# EAGLE design LunettaAV_WIP (EAGLE 9.6.2)
CNAME: Sourya Sen; CREVISION: 0.0.2

## Sheet 1 of 2
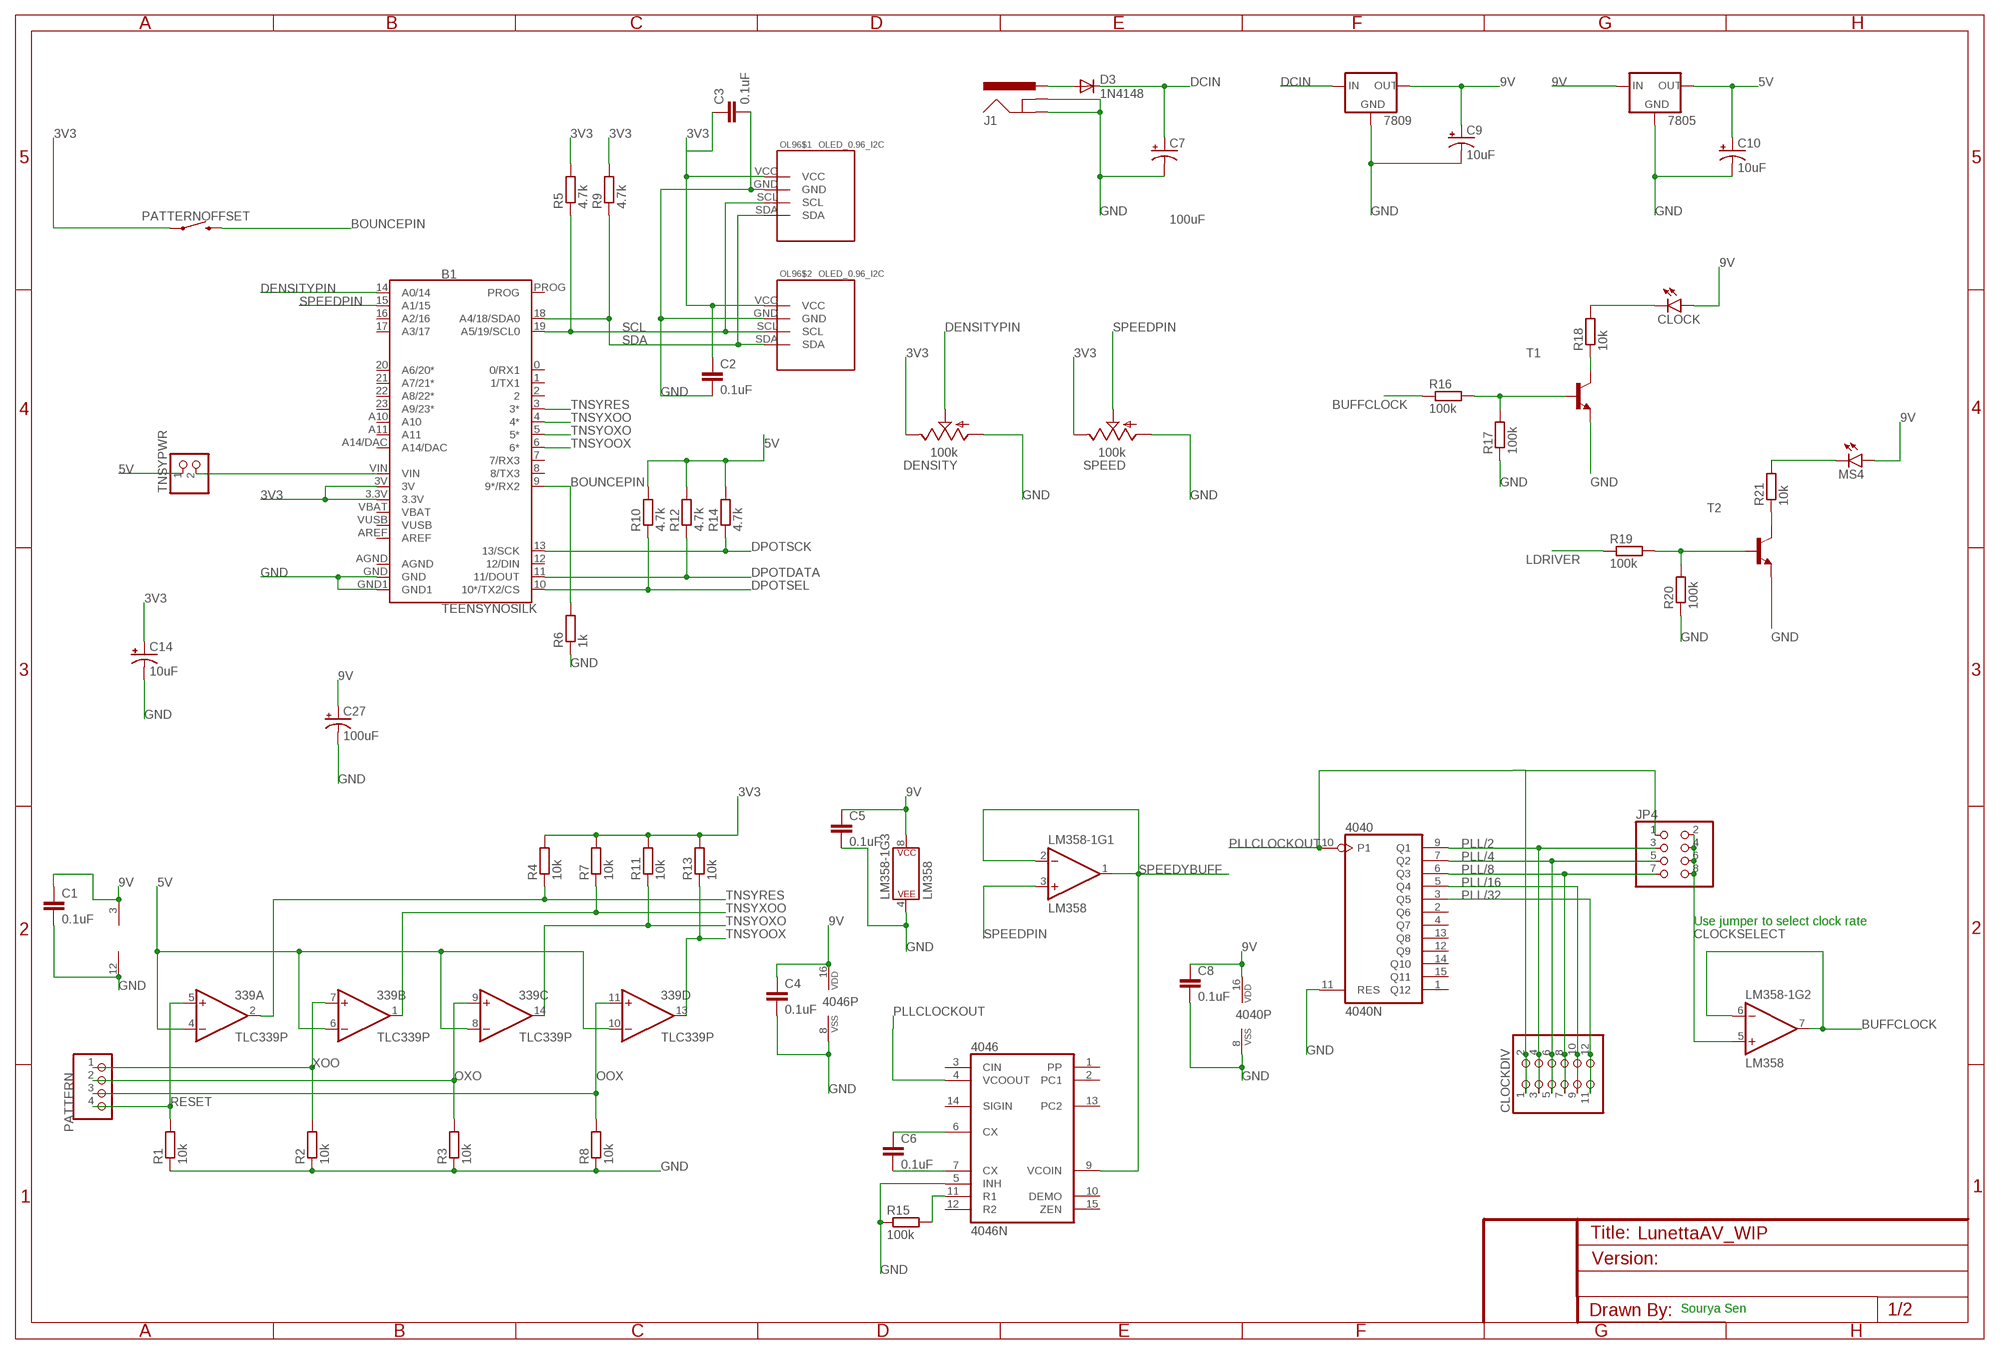
[diagram p0: schematic, sheet 1]

### Parts
339  TLC339P  [DIL14]
4040  4040N  [DIL16]
4046  4046N  [DIL16]
7805  7805  78XXS  [78XXS]
7809  7809  78XXS  [78XXS]
B1  TEENSYNOSILK  [TEENSY_NOSILK]
C1  0.1uF  0.1UF-KIT-EZ-50V-20%  [CAP-PTH-SMALL-KIT]
C2  0.1uF  0.1UF-KIT-EZ-50V-20%  [CAP-PTH-SMALL-KIT]
C3  0.1uF  0.1UF-KIT-EZ-50V-20%  [CAP-PTH-SMALL-KIT]
C4  0.1uF  0.1UF-KIT-EZ-50V-20%  [CAP-PTH-SMALL-KIT]
C5  0.1uF  0.1UF-KIT-EZ-50V-20%  [CAP-PTH-SMALL-KIT]
C6  0.1uF  0.1UF-KIT-EZ-50V-20%  [CAP-PTH-SMALL-KIT]
C7  100uF  100UF-POLAR-RADIAL-2.5MM-25V-20%  [CPOL-RADIAL-2.5MM-6.5MM]
C8  0.1uF  0.1UF-KIT-EZ-50V-20%  [CAP-PTH-SMALL-KIT]
C9  10uF  10UF-POLAR-RADIAL-2.5MM-25V-20%  [CPOL-RADIAL-2.5MM-5MM]
C10  10uF  10UF-POLAR-RADIAL-2.5MM-25V-20%  [CPOL-RADIAL-2.5MM-5MM]
C14  10uF  10UF-POLAR-RADIAL-2.5MM-25V-20%  [CPOL-RADIAL-2.5MM-5MM]
C27  100uF  100UF-POLAR-RADIAL-2.5MM-25V-20%  [CPOL-RADIAL-2.5MM-6.5MM]
CLOCK  LED3MM  [LED_3MM]
CLOCKDIV  PINHD-2X6  [2X06]
D3  1N4148  SMALL_DIODEDO35-7  [DO35-7]
DENSITY  100k  9MM_SNAP-IN_POT_  [9MM_SNAP-IN_POT]
J1  POWER_JACKPOWER_JACK_SLOT  [POWER_JACK_PTH_SLOT]
JP4  PINHD-2X4  [2X04]
LM358-1  LM358  [DIP08]
MS4  LED3MM  [LED_3MM]
OL96$1  OLED_0.96_I2C  [OLED_0.96_I2C]
OL96$2  OLED_0.96_I2C  [OLED_0.96_I2C]
PATTERN  PINHD-1X4  [1X04]
PATTERNOFFSET  MOMENTARY-SWITCH-SPST-PTH-12MM  [TACTILE_SWITCH_PTH_12MM]
R1  10k  RESISTOR7MM  [7MM_RESISTOR]
R2  10k  RESISTOR7MM  [7MM_RESISTOR]
R3  10k  RESISTOR7MM  [7MM_RESISTOR]
R4  10k  RESISTOR7MM  [7MM_RESISTOR]
R5  4.7k  RESISTOR7MM  [7MM_RESISTOR]
R6  1k  RESISTOR7MM  [7MM_RESISTOR]
R7  10k  RESISTOR7MM  [7MM_RESISTOR]
R8  10k  RESISTOR7MM  [7MM_RESISTOR]
R9  4.7k  RESISTOR7MM  [7MM_RESISTOR]
R10  4.7k  RESISTOR7MM  [7MM_RESISTOR]
R11  10k  RESISTOR7MM  [7MM_RESISTOR]
R12  4.7k  RESISTOR7MM  [7MM_RESISTOR]
R13  10k  RESISTOR7MM  [7MM_RESISTOR]
R14  4.7k  RESISTOR7MM  [7MM_RESISTOR]
R15  100k  RESISTOR7MM  [7MM_RESISTOR]
R16  100k  RESISTOR7MM  [7MM_RESISTOR]
R17  100k  RESISTOR7MM  [7MM_RESISTOR]
R18  10k  RESISTOR7MM  [7MM_RESISTOR]
R19  100k  RESISTOR7MM  [7MM_RESISTOR]
R20  100k  RESISTOR7MM  [7MM_RESISTOR]
R21  10k  RESISTOR7MM  [7MM_RESISTOR]
SPEED  100k  9MM_SNAP-IN_POT_  [9MM_SNAP-IN_POT]
T1  2N4401-NPN-TO92-EBC  [TO92-EBC]
T2  2N4401-NPN-TO92-EBC  [TO92-EBC]
TNSYPWR  PINHD-1X2  [1X02]

### Nets
3V3 [POWER]: B1.3.3V B1.3V C2.1 C3.1 C14.1(+) DENSITY.3(E) OL96$1.VCC OL96$2.VCC PATTERNOFFSET.1 R4.2 R5.2 R7.2 R9.2 R11.2 R13.2 SPEED.3(E)
5V [POWER]: 339.4(A:-IN) 339.6(B:-IN) 339.8(C:-IN) 339.10(D:-IN) 7805.OUT C10.1(+) R10.2 R12.2 R14.2 TNSYPWR.1 ; also sheet 2
9V [POWER]: 339.3(P:V+) 4040.16(VDD) 4046.16(VDD) 7805.IN 7809.OUT C1.1 C4.1 C5.1 C8.1 C9.1(+) C27.1(+) CLOCK.A LM358-1.8(P$V+) MS4.A ; also sheet 2
BOUNCEPIN: B1.9(9*/RX2) PATTERNOFFSET.3 R6.2
BUFFCLOCK: LM358-1.6(-IN) LM358-1.7(OUT) R16.1 ; also sheet 2
CLOCKSELECT: JP4.2 JP4.4 JP4.6 JP4.8 LM358-1.5(+IN)
DCIN: 7809.IN C7.1(+) D3.C
DENSITYPIN: B1.14(A0/14) DENSITY.2(S)
DPOTDATA [COMMS]: B1.11(11/DOUT) R12.1 ; also sheet 2
DPOTSCK [COMMS]: B1.13(13/SCK) R14.1 ; also sheet 2
DPOTSEL [COMMS]: B1.10(10*/TX2/CS) R10.1 ; also sheet 2
GND [POWER]: 339.12(P:V-) 4040.8(VSS) 4040.11(RES) 4046.5(INH) 4046.8(VSS) 7805.GND 7809.GND B1.GND B1.GND1 C1.2 C2.2 C3.2 C4.2 C5.2 C7.2(-) C8.2 C9.2(-) C10.2(-) C14.2(-) C27.2(-) DENSITY.1(A) J1.GND J1.GNDBREAK LM358-1.4(P$V-) OL96$1.GND OL96$2.GND R1.1 R2.1 R3.1 R6.1 R8.1 R15.1 R17.1 R20.1 SPEED.1(A) T1.E T2.E ; also sheet 2
LDRIVER: R19.1 ; also sheet 2
N$1: B1.VIN TNSYPWR.2
N$2: 4046.7(CX) C6.2
N$5: 4046.6(CX) C6.1
N$6: 4046.11(R1) R15.2
N$34: R16.2 R17.2 T1.B
N$35: R18.1 T1.C
N$36: CLOCK.K(C) R18.2
N$37: R19.2 R20.2 T2.B
N$38: R21.1 T2.C
N$39: MS4.K(C) R21.2
N$42: D3.A J1.PWR
OOX: 339.11(D:+IN) PATTERN.3 R8.2
OXO: 339.9(C:+IN) PATTERN.2 R3.2
PLL/2: 4040.9(Q1) CLOCKDIV.3 CLOCKDIV.4 JP4.3
PLL/4: 4040.7(Q2) CLOCKDIV.5 CLOCKDIV.6 JP4.5
PLL/8: 4040.6(Q3) CLOCKDIV.7 CLOCKDIV.8 JP4.7
PLL/16: 4040.5(Q4) CLOCKDIV.9 CLOCKDIV.10
PLL/32: 4040.3(Q5) CLOCKDIV.11 CLOCKDIV.12
PLLCLOCKOUT: 4040.10(P1) 4046.4(VCOOUT) CLOCKDIV.1 CLOCKDIV.2 JP4.1
RESET: 339.5(A:+IN) PATTERN.4 R1.2
SCL [COMMS]: B1.19(A5/19/SCL0) OL96$1.SCL OL96$2.SCL R5.1
SDA [COMMS]: B1.18(A4/18/SDA0) OL96$1.SDA OL96$2.SDA R9.1
SPEEDPIN: B1.15(A1/15) LM358-1.3(+IN) SPEED.2(S)
SPEEDYBUFF: 4046.9(VCOIN) LM358-1.1(OUT) LM358-1.2(-IN)
TNSYOOX: 339.13(D:OUT) B1.6(6*) R13.1
TNSYOXO: 339.14(C:OUT) B1.5(5*) R11.1
TNSYRES: 339.2(A:OUT) B1.3(3*) R4.1
TNSYXOO: 339.1(B:OUT) B1.4(4*) R7.1
XOO: 339.7(B:+IN) PATTERN.1 R2.2
Unconnected: 4040.1(Q12) 4040.2(Q6) 4040.4(Q7) 4040.12(Q9) 4040.13(Q8) 4040.14(Q10) 4040.15(Q11) 4046.1(PP) 4046.2(PC1) 4046.3(CIN) 4046.10(DEMO) 4046.12(R2) 4046.13(PC2) 4046.14(SIGIN) 4046.15(ZEN) B1.0(0/RX1) B1.1(1/TX1) B1.2 B1.7(7/RX3) B1.8(8/TX3) B1.12(12/DIN) B1.16(A2/16) B1.17(A3/17) B1.20(A6/20*) B1.21(A7/21*) B1.22(A8/22*) B1.23(A9/23*) B1.A10 B1.A11 B1.A14/DAC B1.AREF B1.PROG

### Notes on the sheet
- Use jumper to select clock rate
- Sourya Sen

## Sheet 2 of 2
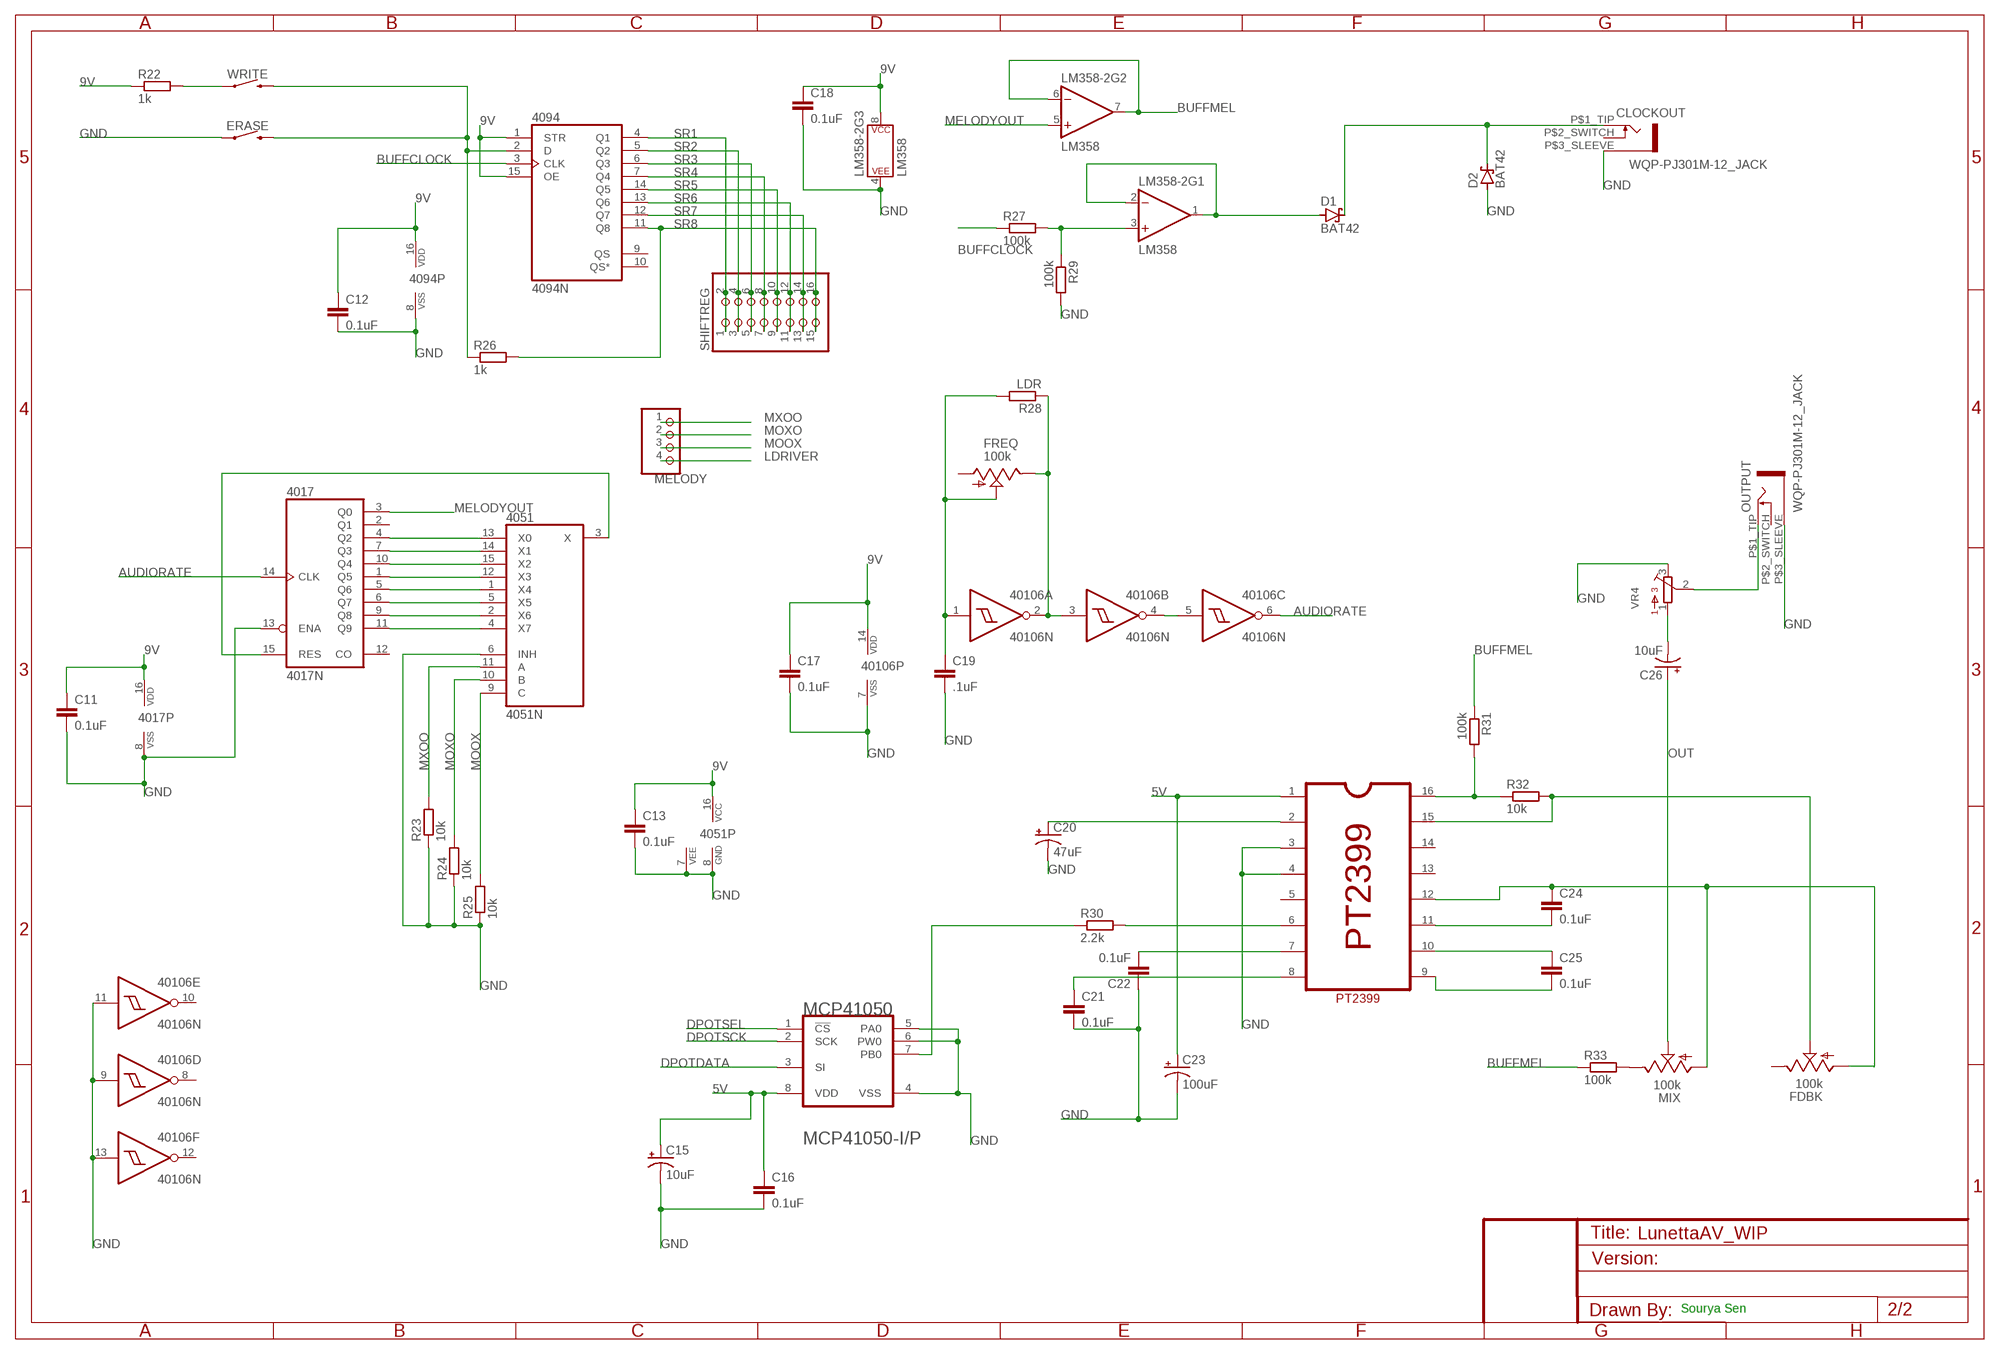
[diagram p1: schematic, sheet 2]

### Parts
4017  4017N  [DIL16]
4051  4051N  [DIL16]
4094  4094N  [DIL16]
40106  40106N  [DIL14]
C11  0.1uF  0.1UF-KIT-EZ-50V-20%  [CAP-PTH-SMALL-KIT]
C12  0.1uF  0.1UF-KIT-EZ-50V-20%  [CAP-PTH-SMALL-KIT]
C13  0.1uF  0.1UF-KIT-EZ-50V-20%  [CAP-PTH-SMALL-KIT]
C15  10uF  10UF-POLAR-RADIAL-2.5MM-25V-20%  [CPOL-RADIAL-2.5MM-5MM]
C16  0.1uF  0.1UF-KIT-EZ-50V-20%  [CAP-PTH-SMALL-KIT]
C17  0.1uF  0.1UF-KIT-EZ-50V-20%  [CAP-PTH-SMALL-KIT]
C18  0.1uF  0.1UF-KIT-EZ-50V-20%  [CAP-PTH-SMALL-KIT]
C19  .1uF  C5/3.5  [C5B3.5]
C20  47uF  10UF-POLAR-RADIAL-2.5MM-25V-20%  [CPOL-RADIAL-2.5MM-5MM]
C21  0.1uF  0.1UF-KIT-EZ-50V-20%  [CAP-PTH-SMALL-KIT]
C22  0.1uF  0.1UF-KIT-EZ-50V-20%  [CAP-PTH-SMALL-KIT]
C23  100uF  100UF-POLAR-RADIAL-2.5MM-25V-20%  [CPOL-RADIAL-2.5MM-6.5MM]
C24  0.1uF  0.1UF-KIT-EZ-50V-20%  [CAP-PTH-SMALL-KIT]
C25  0.1uF  0.1UF-KIT-EZ-50V-20%  [CAP-PTH-SMALL-KIT]
C26  10uF  10UF-POLAR-RADIAL-2.5MM-25V-20%  [CPOL-RADIAL-2.5MM-5MM]
CLOCKOUT  WQP-PJ301M-12_JACK  [WQP-PJ301M-12_JACK]
D1  BAT42  [DO35-10]
D2  BAT42  [DO35-10]
ERASE  MOMENTARY-SWITCH-SPST-PTH-12MM  [TACTILE_SWITCH_PTH_12MM]
FDBK  100k  9MM_SNAP-IN_POT_  [9MM_SNAP-IN_POT]
FREQ  100k  9MM_SNAP-IN_POT_  [9MM_SNAP-IN_POT]
LM358-2  LM358  [DIP08]
MCP41050  MCP41050  MICROCHIP_MCP41050-I-PMICROCHIP_MCP41050-I-P_0_0  [MICROCHIP_MCP41050-I-P_0]
MELODY  PINHD-1X4  [1X04]
MIX  100k  9MM_SNAP-IN_POT_  [9MM_SNAP-IN_POT]
OUTPUT  WQP-PJ301M-12_JACK  [WQP-PJ301M-12_JACK]
PT2399  PT2399  [DIP-16]
R22  1k  RESISTOR7MM  [7MM_RESISTOR]
R23  10k  RESISTOR7MM  [7MM_RESISTOR]
R24  10k  RESISTOR7MM  [7MM_RESISTOR]
R25  10k  RESISTOR7MM  [7MM_RESISTOR]
R26  1k  RESISTOR7MM  [7MM_RESISTOR]
R27  100k  RESISTOR7MM  [7MM_RESISTOR]
R28  LDR  R-EU_0204/2V  [0204V]
R29  100k  RESISTOR7MM  [7MM_RESISTOR]
R30  2.2k  RESISTOR7MM  [7MM_RESISTOR]
R31  100k  RESISTOR7MM  [7MM_RESISTOR]
R32  10k  RESISTOR7MM  [7MM_RESISTOR]
R33  100k  RESISTOR7MM  [7MM_RESISTOR]
SHIFTREG  PINHD-2X8  [2X08]
VR4  BOURNS_3362P_TRIMMERP  [BOURNS_3362P_TRIMMER]
WRITE  MOMENTARY-SWITCH-SPST-PTH-12MM  [TACTILE_SWITCH_PTH_12MM]

### Nets
5V [POWER]: C15.1(+) C16.1 C23.1(+) MCP41050.8(VDD) PT2399.1 ; also sheet 1
9V [POWER]: 4017.16(VDD) 4051.16(VCC) 4094.1(STR) 4094.15(OE) 4094.16(VDD) 40106.14(P:VDD) C11.1 C12.1 C13.1 C17.1 C18.1 LM358-2.8(P$V+) R22.1 ; also sheet 1
AUDIORATE: 4017.14(CLK) 40106.6(C:O)
BUFFCLOCK: 4094.3(CLK) R27.1 ; also sheet 1
BUFFMEL: LM358-2.6(-IN) LM358-2.7(OUT) R31.1 R33.1
DPOTDATA [COMMS]: MCP41050.3(SI) ; also sheet 1
DPOTSCK [COMMS]: MCP41050.2(SCK) ; also sheet 1
DPOTSEL [COMMS]: MCP41050.1(!CS!) ; also sheet 1
GND [POWER]: 4017.8(VSS) 4017.13(ENA) 4051.6(INH) 4051.7(VEE) 4051.8(GND) 4094.8(VSS) 40106.7(P:VSS) 40106.9(D:I) 40106.11(E:I) 40106.13(F:I) C11.2 C12.2 C13.2 C15.2(-) C16.2 C17.2 C18.2 C19.2 C20.2(-) C21.2 C22.1 C23.2(-) CLOCKOUT.P$3_SLEEVE D2.A ERASE.1 LM358-2.4(P$V-) MCP41050.4(VSS) MCP41050.5(PA0) MCP41050.6(PW0) OUTPUT.P$3_SLEEVE PT2399.3 PT2399.4 R23.1 R24.1 R25.1 R29.2 VR4.3 ; also sheet 1
LDRIVER: MELODY.4 ; also sheet 1
MELODYOUT: 4017.3(Q0) LM358-2.5(+IN)
MOOX: 4051.9(C) MELODY.3 R25.2
MOXO: 4051.10(B) MELODY.2 R24.2
MXOO: 4051.11(A) MELODY.1 R23.2
N$3: C24.1 FDBK.1(A) MIX.1(A) PT2399.12
N$4: MIX.3(E) R33.2
N$7: C25.2 PT2399.9
N$8: R22.2 WRITE.1
N$9: 40106.2(A:O) 40106.3(B:I) FREQ.3(E) R28.1
N$10: 40106.4(B:O) 40106.5(C:I)
N$11: 40106.1(A:I) C19.1 FREQ.2(S) R28.2
N$12: C25.1 PT2399.10
N$13: LM358-2.3(+IN) R27.2 R29.1
N$14: D1.A LM358-2.1(OUT) LM358-2.2(-IN)
N$15: PT2399.6 R30.2
N$16: C20.1(+) PT2399.2
N$17: C22.2 PT2399.7
N$18: C21.1 PT2399.8
N$19: 4017.15(RES) 4051.3(X)
N$20: 4017.4(Q2) 4051.13(X0)
N$21: 4017.7(Q3) 4051.14(X1)
N$22: 4017.10(Q4) 4051.15(X2)
N$23: 4017.1(Q5) 4051.12(X3)
N$24: 4017.5(Q6) 4051.1(X4)
N$25: 4017.6(Q7) 4051.5(X5)
N$26: 4017.9(Q8) 4051.2(X6)
N$27: 4017.11(Q9) 4051.4(X7)
N$28: 4094.2(D) ERASE.3 R26.1 WRITE.3
N$29: PT2399.16 R31.2 R32.1
N$30: FDBK.2(S) PT2399.15 R32.2
N$31: C24.2 PT2399.11
N$32: CLOCKOUT.P$1_TIP D1.C D2.C
N$33: MCP41050.7(PB0) R30.1
N$40: OUTPUT.P$1_TIP VR4.2
N$41: C26.2(-) VR4.1
OUT: C26.1(+) MIX.2(S)
SR1: 4094.4(Q1) SHIFTREG.1 SHIFTREG.2
SR2: 4094.5(Q2) SHIFTREG.3 SHIFTREG.4
SR3: 4094.6(Q3) SHIFTREG.5 SHIFTREG.6
SR4: 4094.7(Q4) SHIFTREG.7 SHIFTREG.8
SR5: 4094.14(Q5) SHIFTREG.9 SHIFTREG.10
SR6: 4094.13(Q6) SHIFTREG.11 SHIFTREG.12
SR7: 4094.12(Q7) SHIFTREG.13 SHIFTREG.14
SR8: 4094.11(Q8) R26.2 SHIFTREG.15 SHIFTREG.16
Unconnected: 4017.2(Q1) 4017.12(CO) 4094.9(QS) 4094.10(QS*) 40106.8(D:O) 40106.10(E:O) 40106.12(F:O) CLOCKOUT.P$2_SWITCH FDBK.3(E) FREQ.1(A) OUTPUT.P$2_SWITCH PT2399.5 PT2399.13 PT2399.14

### Notes on the sheet
- Sourya Sen

## Power pins joined to a net without a drawn wire
AGND: B1.AGND
VBAT: B1.VBAT
VUSB: B1.VUSB

## Library data of the parts
339 = linear:TLC339: COMPARATOR
4017 = 40xx:4017: COUNTER/DIVIDER
4040 = 40xx:4040: 12-stage binary/ripple COUNTER
4046 = 40xx:4046: Micropower PLL
4051 = 40xx:4051: 8-channel ANALOG MULTIPLEXER
4094 = 40xx:4094: 8-stage SHIFT/STORE REGISTER, tri-state
7805 7809 = v-reg:78XXS: VOLTAGE REGULATOR
40106 = 40xx:40106: Hex SCHMITT TRIGGER
B1 = SparkFun-Boards:TEENSY: Teensy Footprint Mechanical footprint with connectors for Teensy Development Board with ARM Cortex. SparkFun Products: Teensy 4.0 <https://www.sparkfun.com/products/15583> Teensy 4.0 (with Headers) <https://www.sparkfun.com/products/16997> Teensy 3.2 <https://www.sparkfun.com/products/13736> Teensy LC <https://www.sparkfun.com/products/13305> SparkFun Qwiic Shield for Teensy <https://www.sparkfun.com/products/17119> Teensy Header Kit <https://www.sparkfun.com/products/13925>; SF_ID: DEV-12646
C1-C6 C8 C11-C13 C16-C18 C21 C22 C24 C25 = SparkFun-Capacitors:0.1UF: 0.1µF ceramic capacitors A capacitor is a passive two-terminal electrical component used to store electrical energy temporarily in an electric field.; PROD_ID: CAP-08370
C7 C23 C27 = SparkFun-Capacitors:100UF-POLAR: 100µF polarized capacitors A capacitor is a passive two-terminal electrical component used to store electrical energy temporarily in an electric field.; PROD_ID: CAP-08439
C9 C10 C14 C15 C26 = SparkFun-Capacitors:10UF-POLAR: 10.0µF polarized capacitors A capacitor is a passive two-terminal electrical component used to store electrical energy temporarily in an electric field.; PROD_ID: CAP-08440
C19 = capacitor-wima:C: CAPACITOR naming: grid - package width
C20 = SparkFun-Capacitors:10UF-POLAR: 10.0µF polarized capacitors A capacitor is a passive two-terminal electrical component used to store electrical energy temporarily in an electric field.; PROD_ID: CAP-08440; VALUE: 10uF
CLOCK MS4 = SparkFun-LED:LED: LED (Generic) Standard schematic elements and footprints for 5mm, 3mm, 1206, and 0603 sized LEDs. Generic LEDs with no color specified.; PROD_ID: DIO-08794
CLOCKDIV = pinhead:PINHD-2X6: PIN HEADER
CLOCKOUT OUTPUT = MusicThingModular:WQP-PJ301M-12_JACK
D1 D2 = diode:BAT42: DIODE barrier diode
D3 = MusicThingModular:SMALL_DIODE: Small Signal Diode
DENSITY FDBK FREQ MIX SPEED = MusicThingModular:9MM_SNAP-IN_POT: 9mm vertical snap-in pot, Alpha / Panasonic style
ERASE PATTERNOFFSET WRITE = SparkFun-Switches:MOMENTARY-SWITCH-SPST: Momentary Switch (Pushbutton) - SPST Normally-open (NO) SPST momentary switches (buttons, pushbuttons). Variants PTH-12MM - 12mm square, through-hole Momentary Pushbutton Switch - 12mm Square <https://www.sparkfun.com/products/9190> (COM-09190) PTH-6.0MM, PTH-6.0MM-KIT - 6.0mm square, through-hole Mini Pushbutton Switch <https://www.sparkfun.com/products/97> (COM-00097) KIT package intended for soldering kit's - only one side of pads' copper is exposed. PTH-RIGHT-ANGLE-KIT - Right-angle, through-hole Right Angle Tactile Button <https://www.sparkfun.com/products/10791> - Used on SparkFun BigTime Watch Kit <https://www.sparkfun.com/products/11734> SMD-12MM - 12mm square, surface-mount Tactile Button - SMD (12mm) <https://www.sparkfun.com/products/12993> (COM-12993) Used on SparkFun PicoBoard <https://www.sparkfun.com/products/11888> SMD-4.5MM - 4.5mm Square Trackball Switch Used on SparkFun Blackberry Trackballer Breakout <https://www.sparkfun.com/products/13169> SMD-4.6MMX2.8MM - 4.60mm x 2.80mm, surface mount Used on SparkFun Pro Micro - RP2040 <https://www.sparkfun.com/products/17717> SMD-5.2MM, SMD-5.2-REDUNDANT - 5.2mm square, surface-mount Mini Pushbutton Switch - SMD <https://www.sparkfun.com/products/8720> (COM-08720) Used on Arduino Pro Mini <https://www.sparkfun.com/products/11114> REDUNDANT package connects both switch circuits together SMD-6.0X3.5MM - 6.0 x 3.5mm, surface mount Momentary Reset Switch SMD <https://www.sparkfun.com/products/8229> (COM-08229) SMD-6.2MM-TALL - 6.2mm square, surface mount Tactile Button - SMD (6mm) <https://www.sparkfun.com/products/12992> Used on SparkFun Digital Sandbox <https://www.sparkfun.com/products/12651> SMD-RIGHT-ANGLE - Right-angle, surface mount Used on SparkFun Block for Intel® Edison - Arduino <https://www.sparkfun.com/products/13036>; PROD_ID: SWCH-09185; SF_SKU: COM-09190
J1 = SparkFun-Connectors:POWER_JACK: Power Jack Connector This is the standard 5.5mm barrel jack for power. The PTH is the most common, proven, reliable, footprint. The Slot footprint only works if the mill layer is transmitted to the PCB fab house so be warned. Here are the connectors we sell at SparkFun: DC Barrel Power Jack/Connector <https://www.sparkfun.com/products/119> (PRT-00119) DC Barrel Power Jack/Connector (SMD) <https://www.sparkfun.com/products/12748> (PRT-12748) DC Barrel Jack Adapter - Breadboard Compatible <https://www.sparkfun.com/products/10811> (PRT-10811) It is used on this SparkFun product (and many, many others): SparkFun RedBoard - Programmed with Arduino <https://www.sparkfun.com/products/12757> (DEV-12757) Also, if you need a mating power supply or connector, please check these out: Wall Adapter Power Supply - 9VDC 650mA <https://www.sparkfun.com/products/298> (TOL-00298) DC Barrel Jack Adapter - Male <https://www.sparkfun.com/products/10287> (PRT-10287); PROD_ID: CONN-08197
JP4 = adafruit:PINHD-2X4: PIN HEADER
LM358-1 LM358-2 = SparkFun-IC-Amplifiers:LM358: LM358 Jellybean op-amp Datasheet <http://www.sparkfun.com/datasheets/Components/General/LM358.pdf> SparkFun Products Op-Amp (Thru-Hole) - LM358 <https://www.sparkfun.com/products/9456> (COM-09456); PROD_ID: IC-09172
MCP41050 = MCP41050:MICROCHIP_MCP41050-I-P: IN-DPOT-MCP41XXX-8; CIIVA_IDS: 965827; CODE__JEDEC: MS-001; COMPONENT_LINK_1_DESCRIPTION: Manufacturer URL; COMPONENT_LINK_1_URL: http://www.microchip.com/; COMPONENT_LINK_3_DESCRIPTION: Package Specification; COMPONENT_LINK_3_URL: http://www.microchip.com/stellent/groups/techpub_sg/documents/packagingspec/en012702.pdf; DATASHEET: http://ww1.microchip.com/downloads/en/DeviceDoc/11195c.pdf; DATASHEET_VERSION: Jul-2003; FOOTPRINT_VARIANT_NAME_0: Manufacturer Recommended; IMPORTED: yes; IMPORTED_FROM: vault; IMPORT_TS: 1521866433; MF: Microchip; MPN: MCP41050-I/P; PACKAGE: PDIP300-P8; PACKAGE_DESCRIPTION: 8-Lead Plastic Dual In-Line (P) - 300 mil Body [PDIP]; PACKAGE_VERSION: revBB, Aug-2009; PIN_0_0_3_INSIDE_EDGE: clock; PREFIX: U; RELEASE_DATE: 1331947897; VAULT_GUID: 8499BC26-C1FC-4B90-9420-E4A686EE06B6; VAULT_REVISION: 41824CE8-0B62-48CA-9CA7-4E0BC05643CA
MELODY PATTERN = pinhead:PINHD-1X4: PIN HEADER
OL96$1 OL96$2 = tft_1_8_1_44_oled_0_96:OLED_0.96_I2C
PT2399 = ic-princeton-technologies:PT2399
R1-R27 R29-R33 = MusicThingModular:RESISTOR: Standard resistor, various versions
R28 = rcl:R-EU_: RESISTOR, European symbol; SPICEPREFIX: R
SHIFTREG = pinhead:PINHD-2X8: PIN HEADER
T1 T2 = transistor-neu-to92:*-NPN-: NPN Transistror
TNSYPWR = pinhead:PINHD-1X2: PIN HEADER
VR4 = MusicThingModular:BOURNS_3362P_TRIMMER: 3362 Series 1/4" Square Trimmer

## Net classes
1 POWER: width 0.635 mm, clearance 0.508 mm
2 COMMS: width 0.635 mm, clearance 0.508 mm

## Board
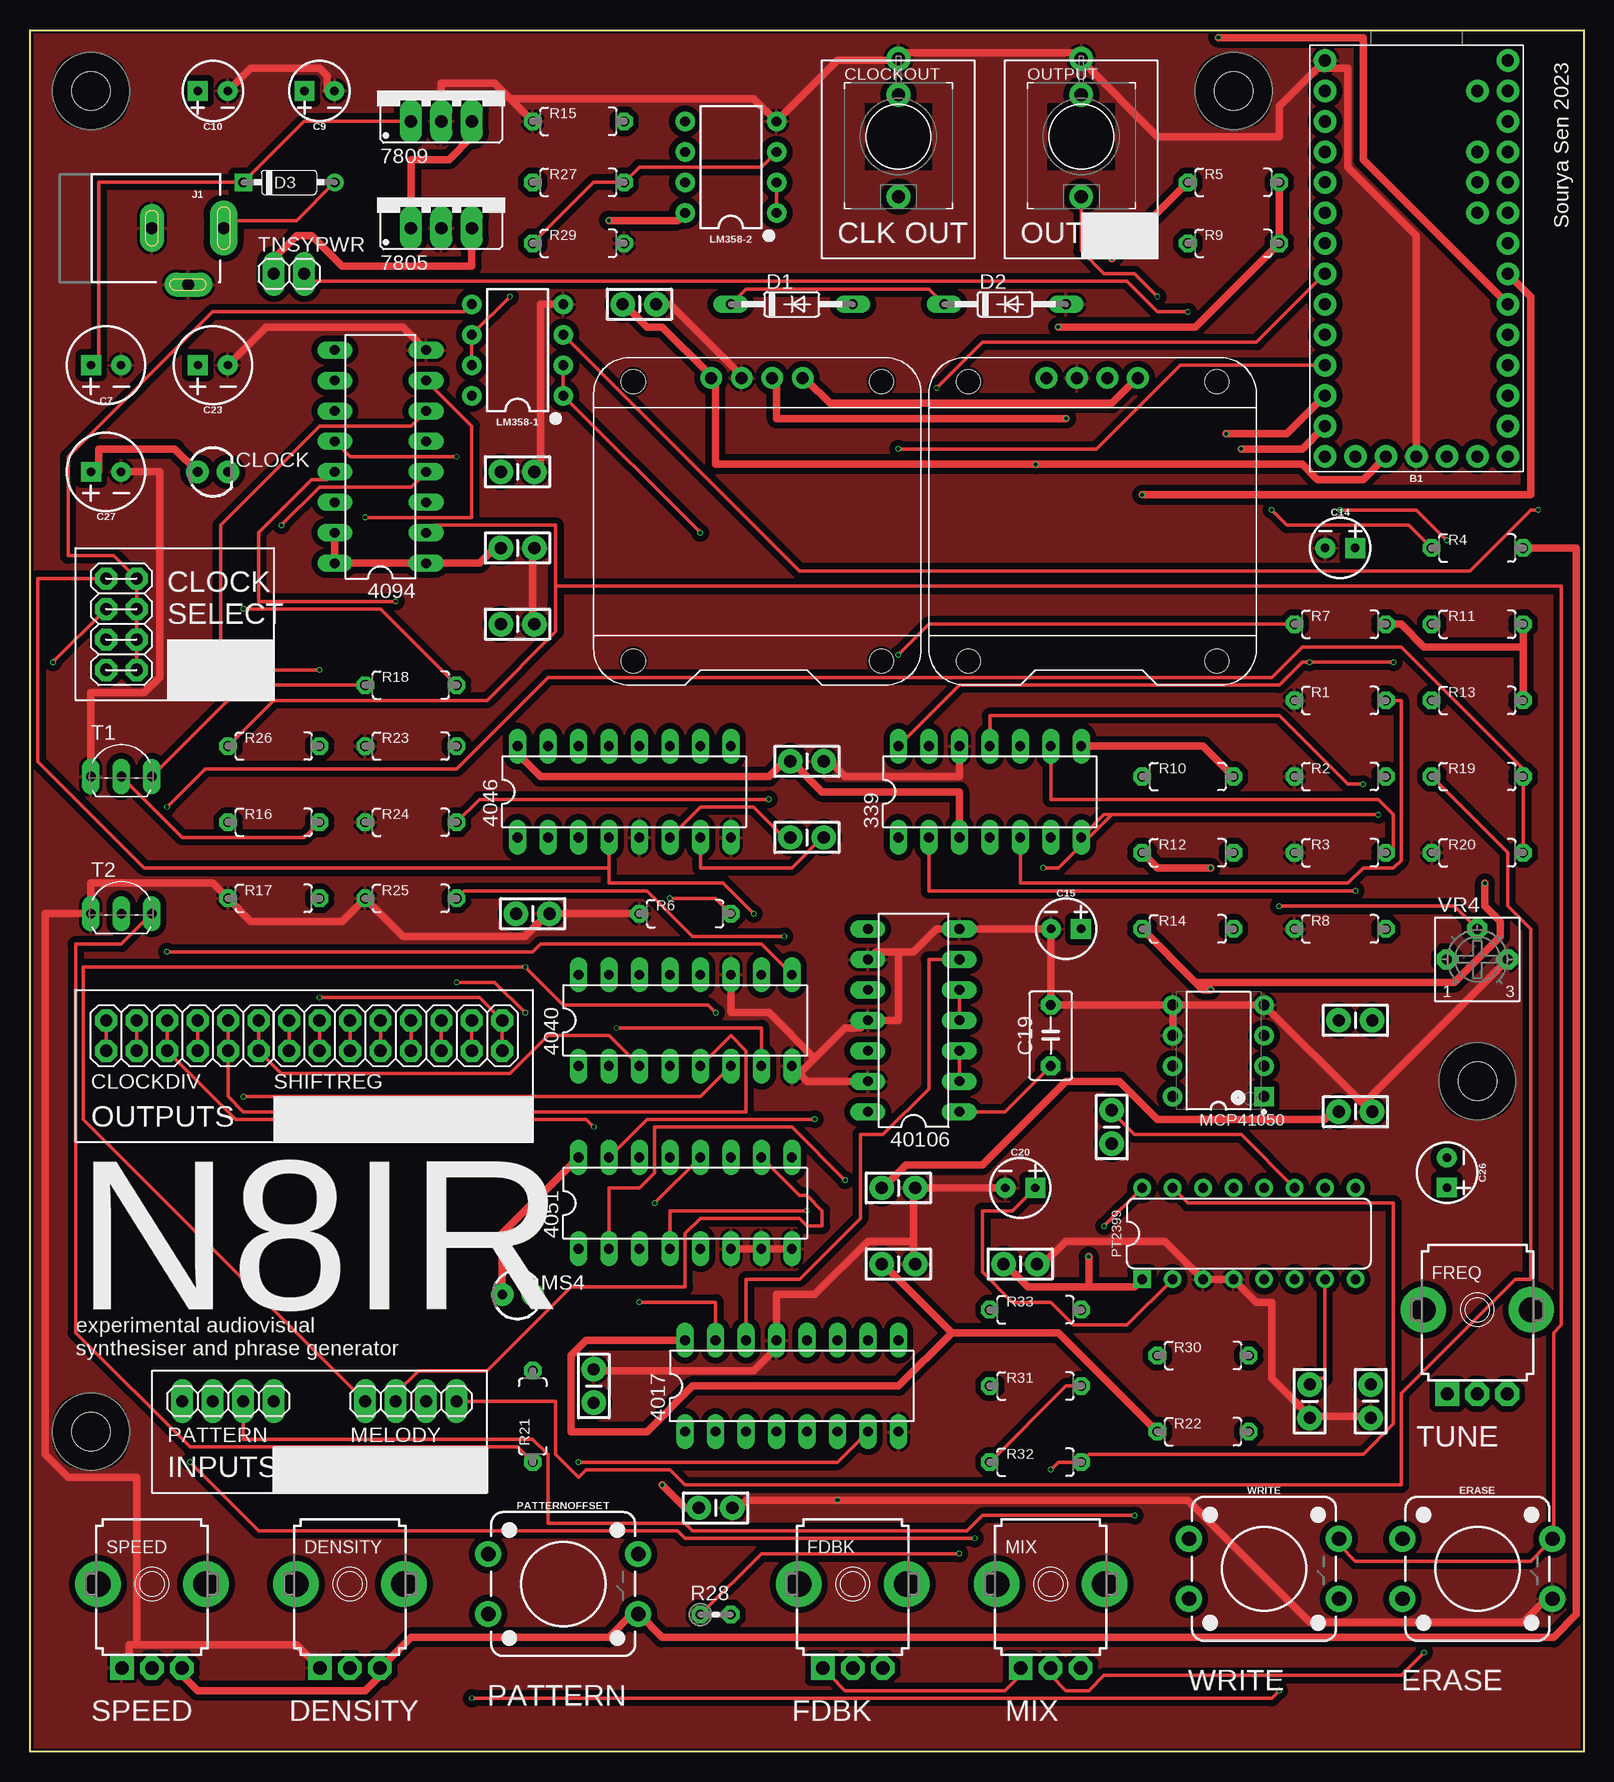
[diagram p2: board, top side]
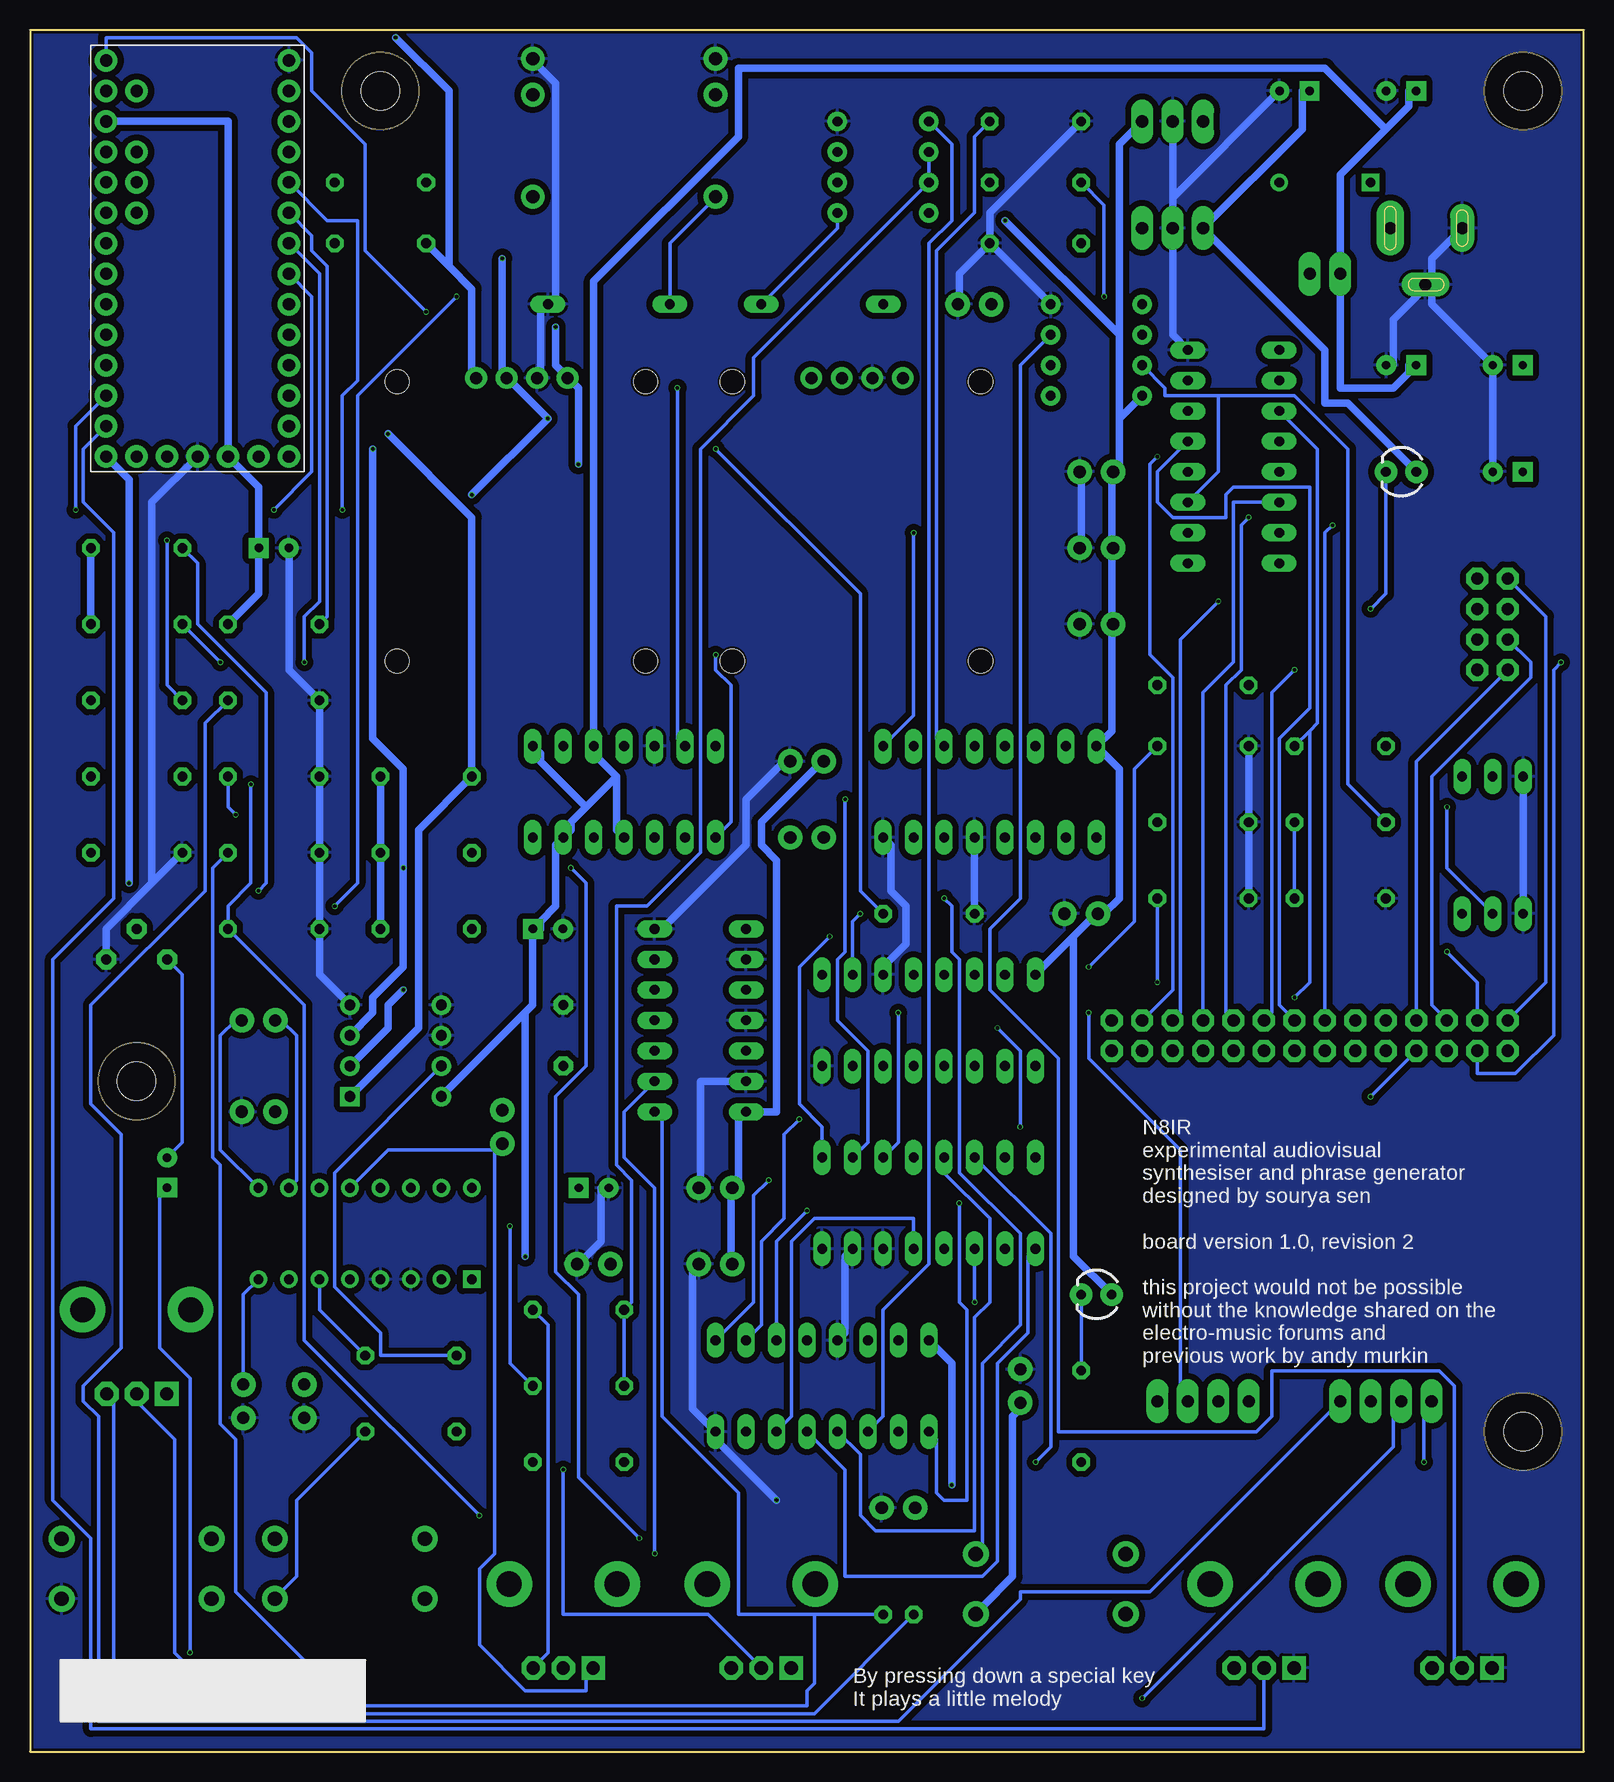
[diagram p3: board, bottom side, seen from below]

Size 129.54 x 143.51 mm. Coordinates in mm from the lower left corner, seen from the top.
Outline: 0,0 0,143.51 129.54,143.51 129.54,0 0,0
Copper layers (1*16): Top 0.035mm / dielectric 1.6mm / Bottom 0.035mm
Design rules "jlcpcb-2layers *": minimum track width 12mil, minimum drill 0.3mm, track to track 12mil, track to pad 12mil, pad to pad 12mil, via to via 12mil, smd to smd 5mil, copper to edge 0.2mm, drill to drill 12mil, minimum pad ring 10mil, minimum via ring 3mil, stop-mask expansion 4mil, vias tented up to drill 0mil, thermal gap 10mil

### Footprints (pad centres in the part's own frame; a part is rotated, then mirrored left to right if it is on the bottom)
DIL14 = drill 0.813 long: 1 -7.62,-3.81; 2 -5.08,-3.81; 3 -2.54,-3.81; 4 0,-3.81; 5 2.54,-3.81; 6 5.08,-3.81; 7 7.62,-3.81; 8 7.62,3.81; 9 5.08,3.81; 10 2.54,3.81; 11 0,3.81; 12 -2.54,3.81; 13 -5.08,3.81; 14 -7.62,3.81
DIL16 = drill 0.813 long: 1 -8.89,-3.81; 2 -6.35,-3.81; 3 -3.81,-3.81; 4 -1.27,-3.81; 5 1.27,-3.81; 6 3.81,-3.81; 7 6.35,-3.81; 8 8.89,-3.81; 9 8.89,3.81; 10 6.35,3.81; 11 3.81,3.81; 12 1.27,3.81; 13 -1.27,3.81; 14 -3.81,3.81; 15 -6.35,3.81; 16 -8.89,3.81
78XXS = drill 1.016 long: GND 0,-2.54; IN -2.54,-2.54; OUT 2.54,-2.54
TEENSY_NOSILK = drill 1.016 pad 1.88: 0 7.62,-13.97; 1 7.62,-11.43; 2 7.62,-8.89; 3 7.62,-6.35; 3.3V 2.54,16.51; 3V -7.62,-11.43; 4 7.62,-3.81; 5 7.62,-1.27; 6 7.62,1.27; 7 7.62,3.81; 8 7.62,6.35; 9 7.62,8.89; 10 7.62,11.43; 11 7.62,13.97; 12 7.62,16.51; 13 -7.62,16.51; 14 -7.62,13.97; 15 -7.62,11.43; 16 -7.62,8.89; 17 -7.62,6.35; 18 -7.62,3.81; 19 -7.62,1.27; 20 -7.62,-1.27; 21 -7.62,-3.81; 22 -7.62,-6.35; 23 -7.62,-8.89; A10 -5.08,-6.35; A11 -5.08,-3.81; A14/DAC -5.08,16.51; AGND -7.62,-13.97; AREF -5.08,-8.89; GND 0,16.51; GND1 7.62,-16.51; PROG -2.54,16.51; VBAT 5.08,16.51; VIN -7.62,-16.51; VUSB -5.08,-13.97
CAP-PTH-SMALL-KIT = drill 1.016 pad 2.032: 1 -1.397,0; 2 1.397,0
CPOL-RADIAL-2.5MM-6.5MM = drill 0.7 pad 1.651 square: 1 1.25,0 | drill 0.7 pad 1.651: 2 -1.25,0
CPOL-RADIAL-2.5MM-5MM = drill 0.7 pad 1.651 square: 1 1.25,0 | drill 0.7 pad 1.651: 2 -1.25,0
C5B3.5 = drill 0.813 pad 1.6 octagon: 1 -2.54,0; 2 2.54,0
LED_3MM = drill 0.813 pad 1.88: A -1.27,0; K 1.27,0
2X06 = drill 1.016 octagon: 1 -6.35,-1.27; 2 -6.35,1.27; 3 -3.81,-1.27; 4 -3.81,1.27; 5 -1.27,-1.27; 6 -1.27,1.27; 7 1.27,-1.27; 8 1.27,1.27; 9 3.81,-1.27; 10 3.81,1.27; 11 6.35,-1.27; 12 6.35,1.27
WQP-PJ301M-12_JACK = drill 1.1: P$1_TIP 0,5; P$2_SWITCH 0,-3.5; P$3_SLEEVE 0,-6.5
DO35-10 = drill 0.813 long: A 5.08,0; C -5.08,0
DO35-7 = drill 0.813: A 3.81,0 | drill 0.813 square: C -3.81,0
9MM_SNAP-IN_POT = drill 1.1 square: 1 -2.5,-7 | drill 1.1 octagon: 2 0,-7; 3 2.5,-7 | drill 2.1 pad 2.794: CHASSIS1 -4.5,0; CHASSIS2 4.5,0
TACTILE_SWITCH_PTH_12MM = drill 1.2 pad 2.159: 1 6.25,-2.5; 2 -6.25,-2.5; 3 6.25,2.5; 4 -6.25,2.5
POWER_JACK_PTH_SLOT = drill 1 pad 2 long: GND 0,0; GNDBREAK -3.048,4.699 | drill 1 pad 2.3 long: PWR -5.969,0
2X04 = drill 1.016 pad 1.676 octagon: 1 -3.81,-1.27; 2 -3.81,1.27; 3 -1.27,-1.27; 4 -1.27,1.27; 5 1.27,-1.27; 6 1.27,1.27; 7 3.81,-1.27; 8 3.81,1.27
DIP08 = drill 0.813 pad 1.626: 1 -3.81,-3.81; 2 -1.27,-3.81; 3 1.27,-3.81; 4 3.81,-3.81; 5 3.81,3.81; 6 1.27,3.81; 7 -1.27,3.81; 8 -3.81,3.81
MICROCHIP_MCP41050-I-P_0 = drill 0.9 pad 1.5 square: 1 -3.81,3.81 | drill 0.9 pad 1.5: 2 -3.81,1.27; 3 -3.81,-1.27; 4 -3.81,-3.81; 5 3.81,-3.81; 6 3.81,-1.27; 7 3.81,1.27; 8 3.81,3.81
1X04 = drill 1.016 long: 1 -3.81,0; 2 -1.27,0; 3 1.27,0; 4 3.81,0
OLED_0.96_I2C = drill 1 pad 1.778: GND -1.63,11.63; SCL 0.91,11.63; SDA 3.45,11.63; VCC -4.17,11.63 | hole 2: -10.67,-11.97; 10.03,-11.97; 10.03,11.33; -10.67,11.33
DIP-16 = drill 0.813 square: 1 -8.89,-3.81 | drill 0.813: 2 -6.35,-3.81; 3 -3.81,-3.81; 4 -1.27,-3.81; 5 1.27,-3.81; 6 3.81,-3.81; 7 6.35,-3.81; 8 8.89,-3.81; 9 8.89,3.81; 10 6.35,3.81; 11 3.81,3.81; 12 1.27,3.81; 13 -1.27,3.81; 14 -3.81,3.81; 15 -6.35,3.81; 16 -8.89,3.81
7MM_RESISTOR = drill 0.813 octagon: 1 -3.81,0; 2 3.81,0
0204V = drill 0.813 octagon: 1 -1.27,0; 2 1.27,0
2X08 = drill 1.016 octagon: 1 -8.89,-1.27; 2 -8.89,1.27; 3 -6.35,-1.27; 4 -6.35,1.27; 5 -3.81,-1.27; 6 -3.81,1.27; 7 -1.27,-1.27; 8 -1.27,1.27; 9 1.27,-1.27; 10 1.27,1.27; 11 3.81,-1.27; 12 3.81,1.27; 13 6.35,-1.27; 14 6.35,1.27; 15 8.89,-1.27; 16 8.89,1.27
TO92-EBC = drill 0.813 long: B 0,-1.27; C 2.54,-1.27; E -2.54,-1.27
1X02 = drill 1.016 long: 1 -1.27,0; 2 1.27,0
MOUNTING_HOLE = hole 3.2: 0,0
BOURNS_3362P_TRIMMER = drill 0.813 pad 1.676 octagon: 1 -2.54,0; 2 0,2.54; 3 2.54,0

### Placement (x,y rotation side)
339  80.01,80.01 0 top
4017  63.5,30.48 0 top
4040  54.61,60.96 0 top
4046  49.53,80.01 0 top
4051  54.61,45.72 0 top
4094  29.21,107.95 90 top
7805  34.29,129.54 0 top
7809  34.29,138.43 0 top
40106  73.66,60.96 90 top
B1  115.57,124.46 180 top
C1  40.64,106.68 0 top
C2  50.8,120.65 0 top
C3  46.99,30.48 90 top
C4  64.77,82.55 0 top
C5  40.64,93.98 0 top
C6  64.77,76.2 0 top
C7  6.35,115.57 180 top
C8  72.39,40.64 0 top
C9  24.13,138.43 180 top
C10  15.24,138.43 180 top
C11  57.15,20.32 0 top
C12  40.64,100.33 0 top
C13  110.49,53.34 0 top
C14  109.22,100.33 0 top
C15  86.36,68.58 0 top
C16  82.55,40.64 0 top
C17  72.39,46.99 0 top
C18  41.91,69.85 0 top
C19  85.09,59.69 90 top
C20  82.55,46.99 0 top
C21  111.76,29.21 270 top
C22  106.68,29.21 90 top
C23  15.24,115.57 180 top
C24  90.17,52.07 90 top
C25  110.49,60.96 0 top
C26  118.11,48.26 270 top
C27  6.35,106.68 180 top
CLOCK  15.24,106.68 0 top
CLOCKDIV  12.7,59.69 0 top
CLOCKOUT  72.39,134.62 180 top
D1  63.5,120.65 0 top
D2  81.28,120.65 0 top
D3  21.59,130.81 0 top
DENSITY  26.67,13.97 0 top
ERASE  120.65,15.24 0 top
FDBK  68.58,13.97 0 top
FREQ  120.65,36.83 0 top
J1  10.16,127 180 top
JP4  7.62,93.98 270 top
LM358-1  40.64,116.84 90 top
LM358-2  58.42,132.08 90 top
MCP41050  99.06,58.42 180 top
MELODY  31.75,29.21 0 top
MIX  85.09,13.97 0 top
MS4  40.64,38.1 0 top
OL96$1  88.9,102.87 0 top
OL96$2  60.96,102.87 0 top
OUTPUT  87.63,134.62 180 top
PATTERN  16.51,29.21 0 top
PATTERNOFFSET  44.45,13.97 0 top
PT2399  101.6,43.18 0 top
R1  109.22,87.63 0 top
R2  109.22,81.28 0 top
R3  109.22,74.93 0 top
R4  120.65,100.33 0 top
R5  100.33,130.81 0 top
R6  54.61,69.85 0 top
R7  109.22,93.98 0 top
R8  109.22,68.58 0 top
R9  100.33,125.73 0 top
R10  96.52,81.28 0 top
R11  120.65,93.98 0 top
R12  96.52,74.93 0 top
R13  120.65,87.63 0 top
R14  96.52,68.58 0 top
R15  45.72,135.89 0 top
R16  20.32,77.47 0 top
R17  20.32,71.12 0 top
R18  31.75,88.9 0 top
R19  120.65,81.28 0 top
R20  120.65,74.93 0 top
R21  41.91,27.94 90 top
R22  97.79,26.67 0 top
R23  31.75,83.82 0 top
R24  31.75,77.47 0 top
R25  31.75,71.12 0 top
R26  20.32,83.82 0 top
R27  45.72,130.81 0 top
R28  57.15,11.43 0 top
R29  45.72,125.73 0 top
R30  97.79,33.02 0 top
R31  83.82,30.48 0 top
R32  83.82,24.13 0 top
R33  83.82,36.83 0 top
SHIFTREG  30.48,59.69 0 top
SPEED  10.16,13.97 0 top
T1  7.62,82.55 0 top
T2  7.62,71.12 0 top
TNSYPWR  21.59,123.19 0 top
U$1  [MOUNTING_HOLE]  100.33,138.43 0 top
U$2  [MOUNTING_HOLE]  5.08,138.43 0 top
U$3  [MOUNTING_HOLE]  5.08,26.67 0 top
U$4  [MOUNTING_HOLE]  120.65,55.88 0 top
VR4  120.65,66.04 0 top
WRITE  102.87,15.24 0 top

### Tracks (layer width: path | path; a pad name or v marks a point on that pad's centre or on a via)
3V3  (via drill 0.3)
  Top 0.635: SPEED.3 12.7,6.35 13.97,5.08 27.94,5.08 29.21,6.35 DENSITY.3 29.21,6.98 31.75,9.53 48.26,9.53 50.16,11.43 PATTERNOFFSET.1 50.8,11.43 52.7,9.53 127,9.53 128.91,11.43 128.91,100.33 R4.2 | R5.2 R9.2 97.16,118.74 v85.72,118.74 | C2.1 49.53,120.65 51.44,118.74 52.7,118.74 56.52,114.94 OL96$2.VCC 57.15,114.3 57.15,107.31 v83.82,107.31 106.05,107.31 107.31,106.05 111.12,106.05 B1.3.3V | R11.2 124.46,92.08 | 124.46,92.08 R13.2 | 124.46,92.08 116.2,92.08 114.3,93.98 R7.2
  Bottom 0.635: C3.1 46.99,28.57 47.62,27.94 47.62,14.61 50.16,12.06 PATTERNOFFSET.1 | v85.72,118.74 85.72,115.57 85.09,114.94 OL96$1.VCC 84.45,114.3 83.82,113.66 v83.82,107.31 | R11.2 R4.2 | R7.2 110.49,96.52 110.49,100.33 | 110.49,100.33 110.49,105.41 B1.3.3V 113.03,135.89 B1.3V | 110.49,100.33 C14.1
5V  (via drill 0.3)
  Top 0.635: 7805.OUT 36.83,123.83 26.04,123.83 23.5,126.36 22.23,126.36 20.32,124.46 TNSYPWR.1 | R10.2 97.79,83.82 339.8 | PT2399.1 92.08,38.74 88.27,38.74 | 88.27,38.74 83.19,38.74 81.28,40.64 C16.1 | v88.27,41.28 88.27,38.74
  Bottom 0.635: C23.1 14.61,115.57 14.61,114.94 15.88,113.66 20.32,113.66 TNSYPWR.1 20.32,131.45 16.51,135.26 | 16.51,135.26 14.61,137.16 14.61,138.43 C10.1 | R14.2 R12.2 R10.2 | 339.4 80.64,76.83 80.64,81.28 | 80.64,81.28 82.55,83.19 339.10 82.55,122.55 70.48,134.62 70.48,140.34 21.59,140.34 16.51,135.26 | 80.64,81.28 83.19,78.74 | 83.19,78.74 84.45,77.47 84.45,76.83 339.6 85.72,75.56 85.72,70.48 87,69.21 87,68.58 C15.1 87.63,68.58 87.63,62.23 88.27,61.6 | 339.8 87,83.19 87,82.55 83.19,78.74 | 88.27,61.6 MCP41050.8 | 88.27,61.6 v88.27,41.28
9V  (via drill 0.3)
  Top 0.635: C13.1 108.58,53.34 107.95,52.71 93.98,52.71 90.81,55.88 86.36,55.88 79.38,48.9 73.03,48.9 71.12,46.99 C17.1 | v52.7,22.22 54.61,20.32 C11.1 | R22.1 85.72,34.93 76.83,34.93 | 76.83,34.93 71.12,40.64 C8.1 | 4017.16 46.35,34.29 45.09,33.02 45.09,26.67 51.44,26.67 55.24,30.48 72.39,30.48 76.83,34.93 | CLOCK.A 12.06,108.58 5.71,108.58 5.71,106.68 C27.1 | 4094.15 4094.16 4094.1 37.47,99.06 38.73,100.33 C12.1 | LM358-2.8 53.98,127.63 v48.26,127.63 | 7805.IN 31.75,132.72 34.92,132.72 36.83,134.62 7809.OUT | 339.3 77.47,80.01 66.04,80.01 63.5,82.55 C4.1 62.87,82.55 61.59,81.28 42.55,81.28 40.64,83.19 4046.16 | 4051.16 39.37,43.18 MS4.A
  Bottom 0.635: 4017.16 52.7,32.38 v52.7,22.22 | C8.1 71.12,40.64 71.12,46.99 C17.1 70.48,46.99 70.48,52.71 40106.14 67.31,53.34 67.31,74.3 68.58,75.56 68.58,77.47 63.5,82.55 C4.1 | C9.1 23.5,138.43 23.5,135.26 7805.IN 21.59,116.84 21.59,112.39 19.68,112.39 CLOCK.A | 38.73,111.12 LM358-1.8 | 38.73,111.12 38.73,106.68 C1.1 39.37,106.68 39.37,100.33 | 38.73,118.11 v48.26,127.63 | 38.73,111.12 38.73,118.11 | 7809.OUT 38.73,133.99 38.73,118.11 | 42.55,67.94 40.64,69.85 C18.1 40.01,69.85 38.73,71.12 38.73,81.91 4046.16 39.37,85.09 39.37,93.98 | 42.55,67.94 4040.16 | MS4.A 42.55,41.28 42.55,67.94 | 39.37,93.98 39.37,100.33 | 39.37,100.33 C12.1 | 39.37,93.98 C5.1
AUDIORATE
  Top 0.305: 4017.14 59.69,39.37 64.14,39.37 69.22,44.45 69.22,51.44 71.12,51.44 74.93,55.25 74.93,66.04 40106.6
BOUNCEPIN  (via drill 0.3)
  Top 0.305: R6.2 57.15,71.12 v53.34,71.12 | B1.9 95.89,115.57 88.9,108.58 v72.39,108.58
  Bottom 0.305: v53.34,71.12 52.7,70.48 52.7,66.67 52.07,66.04 52.07,48.26 46.99,43.18 46.99,35.56 50.16,32.38 50.16,16.51 PATTERNOFFSET.3 | v72.39,108.58 60.33,96.52 60.33,71.75 R6.2
BUFFCLOCK  (via drill 0.3)
  Top 0.305: v40.01,121.28 LM358-1.6 LM358-1.7
  Bottom 0.305: R27.1 40.01,128.91 v40.01,121.28 | R16.1 19.68,80.64 19.68,108.58 24.13,113.03 30.48,113.03 | 30.48,113.03 34.92,113.03 34.92,113.66 LM358-1.7 | 4094.3 30.48,106.68 30.48,113.03
BUFFMEL
  Bottom 0.305: LM358-2.6 LM358-2.7 69.22,116.2 69.22,113.03 73.66,108.58 73.66,74.93 78.11,70.48 80.64,70.48 80.64,48.9 79.38,47.62 79.38,37.47 R33.1 R31.1
CLOCKSELECT
  Top 0.305: JP4.8 JP4.6 JP4.4 JP4.2 6.99,99.69 3.17,99.69 3.17,107.95 15.24,120.02 36.2,120.02 LM358-1.5
DCIN
  Top 0.305: 7809.IN 22.86,135.89 D3.C 5.71,130.81 5.71,115.57 C7.1
DENSITYPIN
  Bottom 0.305: B1.14 125.09,108.58 125.09,104.14 122.56,101.6 122.56,71.12 127.64,66.04 127.64,20.95 124.46,17.78 124.46,1.91 26.67,1.91 DENSITY.2
DPOTDATA  (via drill 0.3)
  Top 0.635: R12.1 93.98,73.66 v98.42,73.66 | B1.11 106.05,108.58 v100.97,108.58
  Bottom 0.635: MCP41050.3 100.97,61.6 100.97,62.87 98.42,65.41 v98.42,73.66 98.42,81.91 100.97,84.45 v100.97,108.58
DPOTSCK  (via drill 0.3)
  Top 0.635: 97.16,64.14 97.79,63.5 v98.42,63.5 | 97.16,64.14 R14.1 | v121.28,72.39 121.28,70.48 122.56,69.21 122.56,67.94 118.75,64.14 97.16,64.14
  Bottom 0.635: v98.42,63.5 99.69,62.23 99.69,60.33 MCP41050.2 | B1.13 121.28,106.05 v121.28,72.39
DPOTSEL  (via drill 0.3)
  Top 0.635: B1.10 104.78,109.85 v99.69,109.85
  Bottom 0.635: MCP41050.1 97.16,60.33 97.16,76.83 R10.1 92.71,102.87 v99.69,109.85
GND  (via drill 0.3)
  Top 0.635: MCP41050.5 MCP41050.6 | 111.12,53.98 MCP41050.4 MCP41050.5 | 111.12,53.98 111.76,53.34 C13.2 111.12,53.98 | 111.12,53.98 VR4.3 | 106.68,27.94 111.76,27.94 C21.2 | C16.2 84.45,40.64 86.36,42.55 94.61,42.55 PT2399.3 PT2399.4 102.23,37.47 103.5,37.47 103.5,31.11 106.68,27.94 | 106.68,27.94 C22.1 | 339.12 77.47,81.28 67.94,81.28 66.67,82.55 C4.2 | 85.09,68.58 C19.2 MCP41050.5 | 40106.9 70.48,66.67 72.39,66.67 | 72.39,66.67 73.66,66.67 75.56,68.58 40106.7 85.09,68.58 | 85.09,68.58 C15.2 | 64.14,56.52 64.77,55.88 40106.13 | 64.14,56.52 65.41,57.79 | 65.41,57.79 67.94,60.33 69.22,60.33 40106.11 72.39,60.96 72.39,66.67 | 64.14,56.52 4040.8 | 4040.11 58.42,61.6 61.59,61.6 65.41,57.79 | 4051.6 4051.7 4051.8 | C3.2 46.99,31.75 60.33,31.75 62.23,33.66 4017.13 62.23,38.1 65.41,38.1 69.85,42.55 73.66,42.55 | C20.2 C17.2 73.66,46.99 73.66,42.55 | C11.2 59.05,20.32 59.69,20.95 v67.31,20.95 96.52,20.95 106.68,10.79 124.46,10.79 126.36,12.7 ERASE.1 | 73.66,42.55 73.66,40.64 C8.2 | 8.89,8.89 22.23,8.89 24.13,6.98 DENSITY.1 | 8.89,8.89 8.26,8.89 8.26,6.98 SPEED.1 | R6.1 C18.2 43.18,69.85 41.27,67.94 31.11,67.94 R25.1 26.04,69.21 18.41,69.21 R17.1 15.24,72.39 5.08,72.39 T2.E 1.27,69.85 1.27,24.77 3.17,22.86 8.89,22.86 8.89,8.89 | 107.31,140.34 104.14,137.16 104.14,134.62 93.98,134.62 87.63,140.97 OUTPUT.P$3_SLEEVE 87.63,141.61 72.39,141.61 CLOCKOUT.P$3_SLEEVE 72.39,140.97 67.31,140.97 LM358-2.4 60.33,137.8 40.01,137.8 | C10.2 16.51,138.43 18.41,140.34 24.13,140.34 24.77,139.7 24.77,138.43 C9.2 | 4094.8 31.11,118.74 19.68,118.74 16.51,115.57 C23.2 | C5.2 41.91,93.98 41.91,100.33 C12.2
  Top 0.635: C2.2 53.34,120.65 59.05,114.94 OL96$2.GND | LM358-1.4 42.55,120.65 42.55,106.68 C1.2 | 7809.GND 34.29,139.06 38.73,139.06 40.01,137.8 | R15.1 40.01,137.8 | T1.E 5.08,88.27 9.53,88.27 10.79,89.53 10.79,106.68 C27.2 | B1.GND 115.57,126.36 109.86,132.08 109.86,140.34 107.31,140.34 | 107.31,140.34 B1.GND1
  Bottom 0.635: 119.38,72.39 123.19,68.58 VR4.3 | 119.38,72.39 R20.1 | B1.GND 119.38,104.14 119.38,72.39 | C14.2 107.95,100.33 107.95,90.17 R1.1 R2.1 R3.1 R8.1 105.41,64.77 MCP41050.4 | 40106.7 76.83,68.58 69.85,75.56 69.85,79.38 66.67,82.55 C4.2 | 4046.8 57.78,75.56 57.78,71.75 56.52,70.48 56.52,67.31 58.42,65.41 4040.11 | 4017.13 61.59,34.93 61.59,41.28 4051.7 | C8.2 74.3,40.64 74.3,28.57 4017.8 72.39,26.04 v67.31,20.95 | 40106.13 73.66,55.88 73.66,46.99 C17.2 | C16.2 83.82,40.64 81.92,42.55 81.92,46.99 C20.2 | 4046.5 R6.1 | T1.E T2.E | R23.1 R24.1 R25.1 | OL96$1.GND 87,114.94 87,120.02 D2.A 85.72,121.28 85.72,139.06 87.63,140.97 OUTPUT.P$3_SLEEVE | 7.62,115.57 7.62,106.68 C27.2 | C23.2 15.88,115.57 15.88,119.38 13.34,121.92 J1.GNDBREAK | J1.GND 12.7,124.46 12.7,122.55 J1.GNDBREAK | 7.62,115.57 12.7,120.65 12.7,121.92 J1.GNDBREAK | 7.62,115.57 C7.2 | 4094.8 34.29,118.11 7805.GND 34.29,129.54 | 34.29,129.54 7809.GND | 34.29,129.54 25.4,138.43 C9.2 | C1.2 41.91,106.68 41.91,100.33 C12.2 | R29.2 52.07,123.19 52.07,120.65 C2.2 | R15.1 49.53,128.27 R29.2 | R29.2 LM358-1.4
  pour Top: 0,143.51 129.54,143.51 129.54,0 0,0
  pour Bottom: 0,143.51 0,0 129.54,0 129.54,143.51
LDRIVER
  Top 0.305: R19.1 123.19,74.93 123.19,70.48 125.09,68.58 125.09,39.37 123.83,39.37 114.3,29.84 114.3,22.22 54.61,22.22 53.34,23.5 46.35,23.5 45.72,22.86 43.81,24.77 43.81,29.21 MELODY.4
MELODYOUT
  Bottom 0.305: 4017.3 58.42,27.94 58.42,36.83 54.61,40.64 54.61,125.73 52.7,127.63 52.7,133.99 LM358-2.5
MOOX  (via drill 0.3)
  Top 0.305: R25.2 36.2,71.75 51.44,71.75 55.24,67.94 v62.87,67.94 | v41.27,61.6 38.73,64.14 v35.56,64.14
  Bottom 0.305: v62.87,67.94 65.41,65.41 65.41,53.98 63.5,52.07 4051.9 | MELODY.3 33.66,29.84 33.66,50.17 41.27,57.79 v41.27,61.6 | R25.2 v35.56,64.14
MOXO  (via drill 0.3)
  Top 0.305: 4051.10 64.14,46.36 64.77,46.36 66.04,45.09 66.04,43.82 64.77,43.82 64.14,44.45 55.88,44.45 54.61,43.18 54.61,38.74 45.09,38.74 38.1,31.75 32.38,31.75 30.48,29.84 MELODY.2 | R24.2 37.47,79.38 v61.59,79.38
  Bottom 0.305: v61.59,79.38 61.59,66.67 62.23,66.04 62.23,60.96 59.69,58.42 59.69,50.8 4051.10
MXOO  (via drill 0.3)
  Top 0.305: v57.15,61.6 56.52,62.23 44.45,62.23 v41.27,65.41 4.45,65.41 4.45,52.71 MELODY.1
  Bottom 0.305: 4051.11 57.15,50.8 v57.15,61.6 | v41.27,65.41 37.47,69.21 37.47,81.91 R23.2
N$1  (via drill 0.3)
  Top 0.305: TNSYPWR.2 23.5,122.55 91.44,122.55 93.98,120.02 v96.52,120.02
  Bottom 0.305: v96.52,120.02 101.6,125.09 101.6,133.99 106.05,138.43 106.05,141.61 107.31,142.88 123.19,142.88 B1.VIN
N$2
  Top 0.305: 4046.7 55.88,73.66 63.5,73.66 66.04,76.2 C6.2
N$3
  Top 0.305: FDBK.1 66.67,6.35 67.94,5.08 81.28,5.08 82.55,6.35 MIX.1
  Bottom 0.305: PT2399.12 99.69,50.17 90.81,50.17 | 90.81,50.17 90.17,50.17 C24.1 90.81,50.17 | 90.81,50.17 90.81,16.51 92.08,15.24 92.08,8.89 88.27,5.08 83.19,5.08 83.19,6.35 MIX.1
N$4
  Bottom 0.305: R33.2 86.36,35.56 86.36,8.26 87,7.62 87,6.98 MIX.3
N$5
  Top 0.305: 4046.6 55.88,78.74 60.33,78.74 62.87,76.2 C6.1
N$6
  Bottom 0.305: 4046.11 53.98,84.45 53.98,125.09 50.8,128.27 50.8,134.62 R15.2
N$7
  Bottom 0.305: PT2399.9 113.67,50.17 113.67,59.69 112.39,60.96 C25.2
N$8
  Bottom 0.305: R22.2 107.31,20.95 107.31,14.61 108.58,13.33 WRITE.1
N$9  (via drill 0.3)
  Top 0.305: 40106.3 40106.2 | v77.47,16.51 60.96,16.51 R28.1
  Bottom 0.305: R28.1 64.14,3.17 122.56,3.17 122.56,29.21 FREQ.3 | 40106.2 80.01,53.34 80.01,49.53 77.47,46.99 v77.47,16.51
N$10
  Top 0.305: 40106.5 40106.4
N$11
  Top 0.305: C19.1 81.28,53.34 40106.1
  Bottom 0.305: 64.14,11.43 70.48,11.43 70.48,21.59 76.83,27.94 76.83,52.71 40106.1 | 64.14,11.43 R28.2 | 64.14,11.43 64.14,5.71 64.77,5.08 64.77,3.81 113.03,3.81 117.47,8.26 117.47,26.04 120.65,29.21 FREQ.2
N$12
  Bottom 0.305: PT2399.10 107.31,47.62 107.31,59.69 108.58,60.96 C25.1
N$13
  Top 0.305: R29.1 46.99,130.81 R27.2 50.8,132.08 60.96,132.08 LM358-2.3
N$14
  Top 0.305: LM358-2.1 LM358-2.2
  Bottom 0.305: D1.A 62.23,127 LM358-2.1
N$15
  Bottom 0.305: R30.2 105.41,36.83 PT2399.6
N$16
  Top 0.305: PT2399.2 91.44,35.56 87,35.56 85.09,37.47 81.92,37.47 79.38,40.01 79.38,45.09 81.92,45.09 83.82,46.99 C20.1
N$17
  Top 0.305: PT2399.7 107.95,31.11 106.68,31.11 C22.2
N$18
  Bottom 0.305: PT2399.8 111.76,38.1 C21.1
N$19  (via drill 0.3)
  Top 0.305: 4017.15 57.15,37.47 v50.8,37.47
  Bottom 0.305: 4051.3 v50.8,37.47
N$20
  Bottom 0.305: 4017.4 60.33,24.77 60.33,19.68 59.05,18.41 50.8,18.41 50.8,36.2 49.53,37.47 49.53,44.45 53.34,48.26 4051.13
N$21  (via drill 0.3)
  Top 0.305: 4017.7 67.31,24.13 v45.72,24.13
  Bottom 0.305: v45.72,24.13 44.45,25.4 44.45,43.18 4051.14
N$22  (via drill 0.3)
  Top 0.305: 4051.15 51.44,52.71 v65.41,52.71
  Bottom 0.305: v65.41,52.71 66.67,51.44 66.67,44.45 68.58,42.55 68.58,35.56 4017.10
N$23  (via drill 0.3)
  Top 0.305: 4051.12 v52.07,45.72
  Bottom 0.305: 4017.1 53.98,26.04 53.98,21.59 53.34,20.95 51.44,20.95 51.44,36.83 52.07,37.47 v52.07,45.72
N$24
  Bottom 0.305: 4051.1 46.35,41.28 46.35,34.93 48.9,32.38 48.9,15.88 50.16,14.61 61.59,14.61 61.59,23.5 4017.5
N$25
  Bottom 0.305: 4017.6 66.04,27.94 66.04,42.55 64.14,44.45 55.88,44.45 4051.5
N$26  (via drill 0.3)
  Top 0.305: 4051.2 48.26,46.99 50.8,46.99 52.07,48.26 52.07,52.07 63.5,52.07 v67.94,47.62
  Bottom 0.305: v67.94,47.62 69.22,46.36 69.22,37.47 4017.9
N$27  (via drill 0.3)
  Top 0.305: 4051.4 53.34,45.09 v64.77,45.09
  Bottom 0.305: v64.77,45.09 67.31,42.55 4017.11
N$28
  Top 0.305: WRITE.3 109.22,17.14 110.49,15.88 125.09,15.88 126.36,17.14 ERASE.3 127,17.78 127,34.93 127.64,35.56 127.64,97.16 43.81,97.16 | R26.1 20.32,87.63 38.1,87.63 43.81,93.34 43.81,97.16 | 43.81,97.16 43.81,102.23 33.66,102.23 4094.2
N$29  (via drill 0.3)
  Top 0.305: R32.1 86.36,30.48 R31.2 | v89.53,43.82 PT2399.16
  Bottom 0.305: v89.53,43.82 89.53,32.38 R31.2
N$30  (via drill 0.3)
  Top 0.305: PT2399.15 96.52,45.72 113.67,45.72 113.67,27.3 111.12,24.77 88.27,24.77 R32.2 85.72,24.13 v85.09,23.5
  Bottom 0.305: v85.09,23.5 85.09,11.43 73.03,11.43 68.58,6.98 FDBK.2
N$31
  Top 0.305: PT2399.11 100.97,51.44 92.08,51.44 90.17,53.34 C24.2
N$32
  Top 0.305: D1.C 59.69,121.92 74.93,121.92 D2.C
  Bottom 0.305: D2.C 76.2,125.73 72.39,129.54 CLOCKOUT.P$1_TIP
N$33
  Bottom 0.305: R30.1 100.33,33.02 100.33,34.93 104.14,38.74 104.14,48.26 MCP41050.7
N$34
  Top 0.305: T1.B 12.7,76.2 22.86,76.2 R16.2
  Bottom 0.305: R16.2 R17.2
N$35
  Top 0.305: T1.C 17.78,88.9 R18.1
N$36  (via drill 0.3)
  Top 0.305: R18.2 29.21,95.25 v17.78,95.25
  Bottom 0.305: v17.78,95.25 16.51,96.52 CLOCK.K
N$37  (via drill 0.3)
  Top 0.305: v11.43,78.74 14.61,81.91 35.56,81.91 43.18,89.53 103.5,89.53 106.05,92.08 114.3,92.08 124.46,81.91 R19.2 R20.2
  Bottom 0.305: T2.B 11.43,73.66 v11.43,78.74
N$38
  Top 0.305: R21.1 40.64,25.4 13.34,25.4 3.81,34.93 3.81,67.31 7.62,67.31 T2.C
N$39
  Bottom 0.305: MS4.K R21.2
N$40  (via drill 0.3)
  Top 0.305: VR4.2 118.75,70.48 v104.14,70.48 | v93.98,121.28 92.08,123.19 89.53,123.19 87.63,125.09 OUTPUT.P$1_TIP
  Bottom 0.305: v104.14,70.48 102.23,72.39 102.23,113.03 v93.98,121.28
N$41
  Bottom 0.305: VR4.1 116.84,64.77 116.84,50.8 118.11,49.53 C26.2
N$42
  Top 0.305: D3.A 22.23,127.63 17.14,127.63 16.51,127 J1.PWR
OOX  (via drill 0.3)
  Top 0.305: 339.11 80.01,86.36 104.14,86.36 109.86,80.64 v111.12,80.64 | PATTERN.3 17.78,26.04 41.91,26.04 43.18,24.77 43.18,19.05 54.61,19.05 55.24,18.41 78.11,18.41 79.38,19.68 v92.08,19.68
  Bottom 0.305: v111.12,80.64 111.12,72.39 113.03,70.48 R8.2 106.68,62.23 106.68,34.29 v92.08,19.68
OUT  (via drill 0.3)
  Top 0.305: v116.2,8.26 114.3,6.35 89.53,6.35 88.27,5.08 86.36,5.08 85.09,6.35 MIX.2
  Bottom 0.305: v116.2,8.26 116.2,31.11 118.75,33.66 118.75,46.36 118.11,46.99 C26.1
OXO  (via drill 0.3)
  Top 0.305: 339.9 85.09,79.38 112.39,79.38 113.67,78.1 113.67,74.93 R3.2 | v36.83,4.45 103.5,4.45 v104.14,5.08
  Bottom 0.305: PATTERN.2 15.88,28.57 15.88,25.4 v36.83,4.45 | v104.14,5.08 112.39,13.33 112.39,26.04 113.67,27.3 113.67,48.9 114.3,49.53 114.3,73.66 R3.2
PLL/2  (via drill 0.3)
  Top 0.305: 4040.9 60.96,67.31 42.55,67.31 41.91,66.67 v11.43,66.67 | CLOCKDIV.4 CLOCKDIV.3 | v1.91,90.8 JP4.3
  Bottom 0.305: v11.43,66.67 8.89,64.14 CLOCKDIV.4 | v1.91,90.8 2.54,90.17 2.54,59.69 5.71,56.52 8.89,56.52 CLOCKDIV.3
PLL/4  (via drill 0.3)
  Top 0.305: 4040.7 60.96,60.33 v48.9,60.33 | v46.99,52.07 46.35,52.71 17.14,52.71 CLOCKDIV.5 CLOCKDIV.6
  Bottom 0.305: v48.9,60.33 46.99,58.42 v46.99,52.07 | JP4.5 4.45,90.8 4.45,89.53 12.7,81.28 12.7,62.23 CLOCKDIV.6
PLL/8  (via drill 0.3)
  Top 0.305: 4040.6 55.88,54.61 v17.78,54.61 | CLOCKDIV.7 CLOCKDIV.8
  Bottom 0.305: CLOCKDIV.7 v17.78,54.61 | JP4.7 13.97,82.55 CLOCKDIV.8
PLL/16
  Top 0.305: 4040.5 58.42,59.69 59.69,58.42 59.69,53.34 17.78,53.34 16.51,54.61 CLOCKDIV.9 CLOCKDIV.10
PLL/32
  Top 0.305: 4040.3 48.26,59.69 43.18,59.69 40.01,56.52 20.95,56.52 CLOCKDIV.11 CLOCKDIV.12
PLLCLOCKOUT  (via drill 0.3)
  Top 0.305: 48.26,73.66 48.26,72.39 57.78,72.39 v60.33,69.85 | 48.26,73.66 4046.4 | CLOCKDIV.2 CLOCKDIV.1 | 48.26,73.66 9.53,73.66 0.64,82.55 0.64,97.79 JP4.1
  Bottom 0.305: v60.33,69.85 60.96,69.21 4040.10 | JP4.1 3.17,94.61 3.17,64.14 CLOCKDIV.2
RESET
  Top 0.305: 339.5 82.55,72.39 109.86,72.39 111.12,73.66 113.67,73.66 114.3,74.3 114.3,87.63 R1.2
  Bottom 0.305: PATTERN.4 36.2,13.33 46.99,13.33 46.99,12.7 57.15,2.54 123.83,2.54 123.83,27.94 125.09,29.21 125.09,30.48 121.92,33.66 121.92,51.44 124.46,53.98 124.46,62.23 114.94,71.75 114.94,85.72 R1.2
SCL  (via drill 0.3)
  Top 0.635: v90.17,124.46 R5.1 | v86.36,111.12 62.23,111.12 62.23,114.3 OL96$2.SCL | B1.19 125.09,121.28 125.09,104.77 v92.71,104.77
  Bottom 0.635: v90.17,124.46 90.17,114.94 OL96$1.SCL 89.53,114.3 v86.36,111.12 v92.71,104.77
SDA  (via drill 0.3)
  Top 0.635: OL96$2.SDA 64.77,114.3 66.67,112.39 90.17,112.39 92.08,114.3 OL96$1.SDA | B1.18 111.12,132.72 111.12,142.88 v99.06,142.88
  Bottom 0.635: 94.61,123.83 92.71,121.92 92.71,114.94 OL96$1.SDA | 94.61,123.83 R9.1 | v99.06,142.88 94.61,138.43 94.61,123.83
SPEEDPIN  (via drill 0.3)
  Top 0.305: LM358-1.3 64.14,98.42 120.02,98.42 125.09,103.5 v125.73,103.5
  Bottom 0.305: v125.73,103.5 125.73,110.49 B1.15 | LM358-1.3 46.99,115.57 46.99,71.12 49.53,68.58 49.53,63.5 43.81,57.79 43.81,26.67 27.3,26.67 26.04,27.94 26.04,31.75 12.06,31.75 10.79,30.48 10.79,7.62 10.16,6.98 SPEED.2
SPEEDYBUFF  (via drill 0.3)
  Top 0.305: v55.88,101.6 LM358-1.1 LM358-1.2
  Bottom 0.305: 4046.9 55.88,86.36 v55.88,101.6
SR1  (via drill 0.3)
  Top 0.305: 4094.4 31.75,105.41 24.13,105.41 v20.95,102.23 | SHIFTREG.2 SHIFTREG.1
  Bottom 0.305: v20.95,102.23 21.59,101.6 SHIFTREG.2
SR2
  Top 0.305: SHIFTREG.4 SHIFTREG.3
  Bottom 0.305: 4094.5 35.56,106.68 35.56,104.14 34.29,102.87 29.84,102.87 29.84,104.77 29.21,105.41 22.86,105.41 22.86,86.99 25.4,84.45 25.4,62.23 SHIFTREG.4
SR3  (via drill 0.3)
  Top 0.305: 4094.6 31.75,110.49 24.13,110.49 15.88,102.23 15.88,90.17 v24.13,90.17 | SHIFTREG.6 SHIFTREG.5
  Bottom 0.305: v24.13,90.17 26.04,88.27 26.04,61.6 SHIFTREG.6
SR4  (via drill 0.3)
  Top 0.305: 4094.7 36.83,110.49 36.83,102.87 v27.94,102.87 | SHIFTREG.8 SHIFTREG.7
  Bottom 0.305: v27.94,102.87 28.57,102.23 28.57,90.17 29.84,88.9 29.84,61.6 SHIFTREG.8
SR5
  Top 0.305: SHIFTREG.10 SHIFTREG.9
  Bottom 0.305: 4094.14 29.21,104.14 29.21,90.8 31.75,88.27 SHIFTREG.10
SR6  (via drill 0.3)
  Top 0.305: 4094.13 24.77,106.05 23.5,106.05 19.05,101.6 19.05,95.88 v30.48,95.88 | SHIFTREG.12 SHIFTREG.11
  Bottom 0.305: v30.48,95.88 33.66,92.71 33.66,61.6 SHIFTREG.12
SR7  (via drill 0.3)
  Top 0.305: 4094.12 26.67,107.95 v35.56,107.95 | SHIFTREG.14 SHIFTREG.13
  Bottom 0.305: v35.56,107.95 36.2,107.31 36.2,91.44 34.29,89.53 34.29,63.5 SHIFTREG.14
SR8  (via drill 0.3)
  Top 0.305: SHIFTREG.15 SHIFTREG.16 37.47,62.87 v24.13,62.87
  Bottom 0.305: 22.86,85.09 22.23,85.72 22.23,108.58 4094.11 | 22.86,85.09 R26.2 | v24.13,62.87 22.86,64.14 22.86,85.09
TNSYOOX  (via drill 0.3)
  Top 0.305: v75.56,113.66 79.38,117.47 102.23,117.47 B1.6 | v118.11,100.96 115.57,103.5 v109.22,103.5
  Bottom 0.305: 339.13 75.56,84.45 v75.56,113.66 | R13.1 118.11,88.9 v118.11,100.96 | v109.22,103.5 106.05,106.68 106.05,121.28 B1.6
TNSYOXO  (via drill 0.3)
  Top 0.305: 339.14 77.47,88.9 104.14,88.9 106.05,90.8 v106.68,90.8 v113.67,90.8
  Bottom 0.305: R11.1 v113.67,90.8 | B1.5 105.41,123.19 105.41,95.88 106.68,94.61 v106.68,90.8
TNSYRES  (via drill 0.3)
  Top 0.305: 339.2 74.93,71.75 v110.49,71.75 | v103.5,103.5 104.78,102.23 114.94,102.23 R4.1
  Bottom 0.305: v110.49,71.75 109.86,72.39 109.86,88.27 115.57,93.98 115.57,99.06 R4.1 | B1.3 104.78,127.63 102.23,127.63 102.23,114.3 103.5,113.03 v103.5,103.5
TNSYXOO  (via drill 0.3)
  Top 0.305: v72.39,91.44 74.93,93.98 R7.1
  Bottom 0.305: 339.1 71.12,77.47 71.12,88.9 72.39,90.17 v72.39,91.44 | B1.4 106.05,126.36 106.05,125.09 104.78,123.83 104.78,94.61 R7.1
XOO  (via drill 0.3)
  Top 0.305: 339.7 89.53,78.1 90.17,78.1 | v112.39,78.1 90.17,78.1 | v13.34,24.13 19.05,18.41 53.98,18.41 54.61,17.78 v78.74,17.78 | v84.45,73.66 85.72,73.66 90.17,78.1
  Bottom 0.305: v112.39,78.1 113.03,78.74 R2.2 | PATTERN.1 13.34,28.57 v13.34,24.13 | v78.74,17.78 83.82,22.86 83.82,38.1 85.72,40.01 85.72,54.61 83.19,57.15 83.19,72.39 v84.45,73.66

### Text on the board
tPlace: Sourya Sen 2023 | CLK OUT | OUT | CLOCK / SELECT | OUTPUTS | N8IR | experimental audiovisual / synthesiser and phrase generator | TUNE | INPUTS | WRITE | ERASE | PATTERN | SPEED | DENSITY | FDBK | MIX
bPlace: N8IR / experimental audiovisual / synthesiser and phrase generator / designed by sourya sen / / board version 1.0, revision 2 | this project would not be possible / without the knowledge shared on the / electro-music forums and / previous work by andy murkin | By pressing down a special key / It plays a little melody